# EAGLE design LyteLab_16x16_Base_Rev1 (EAGLE 6.4)
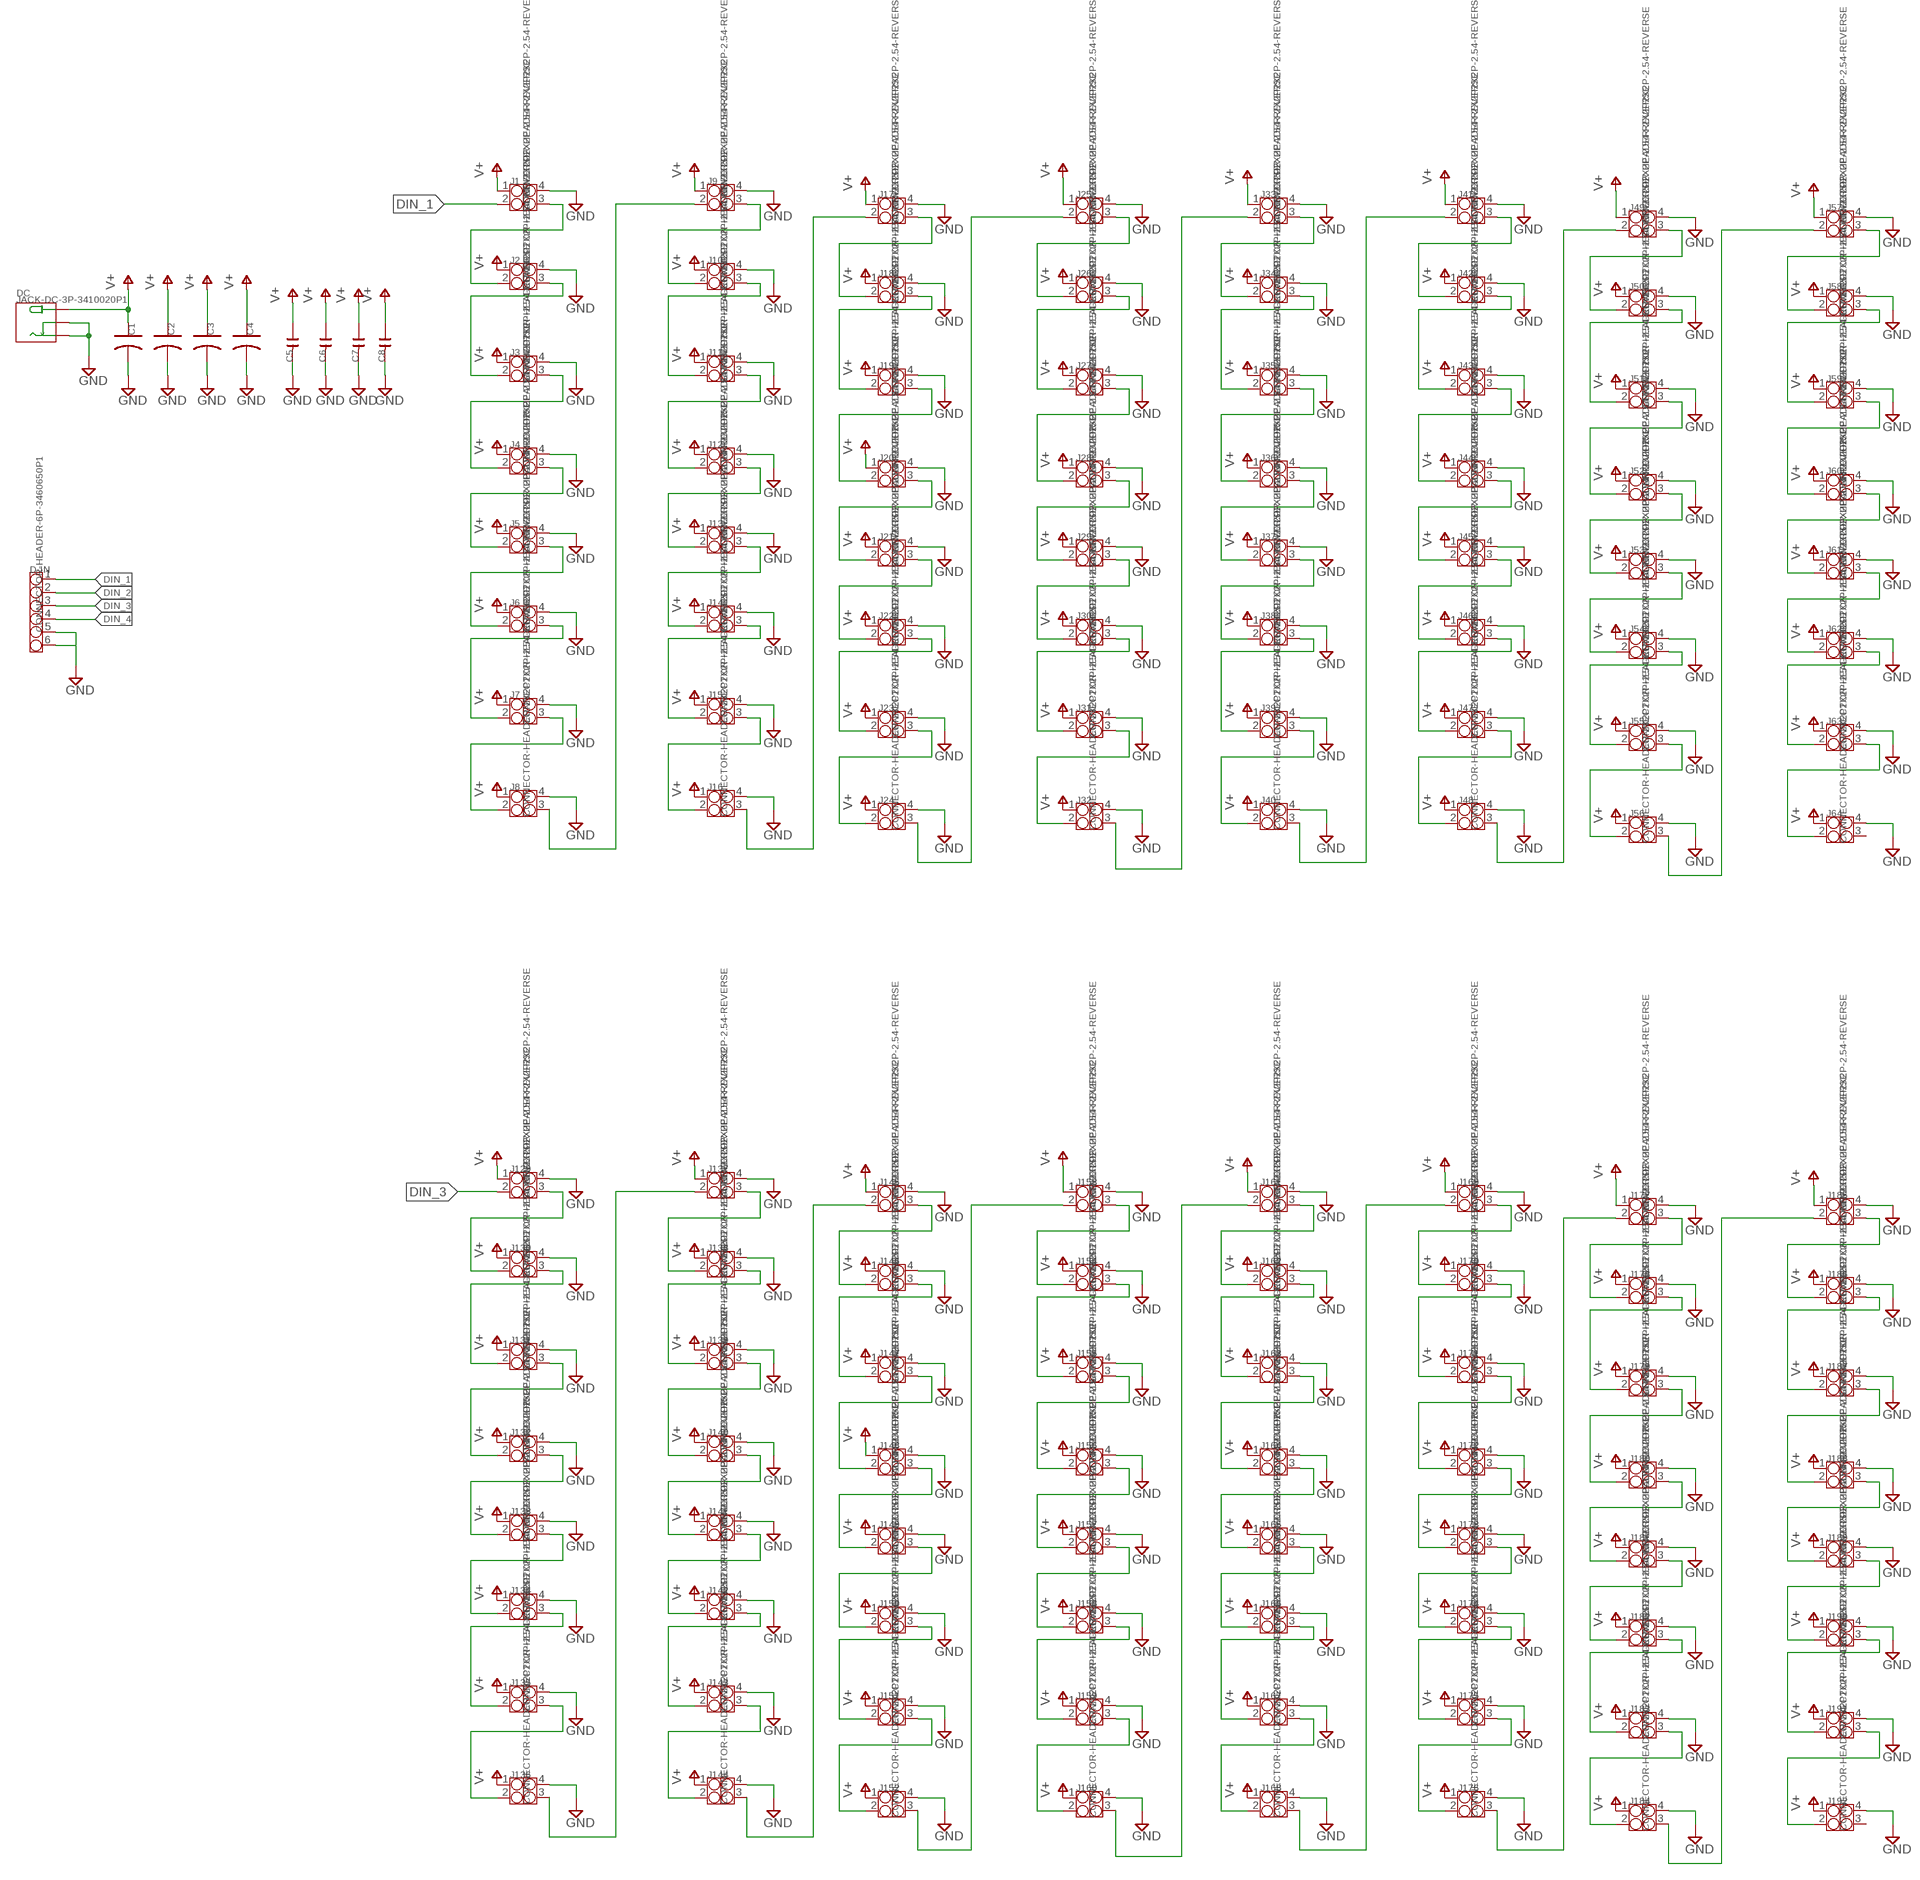
[diagram p0: schematic, sheet 1, part 1 of 2]
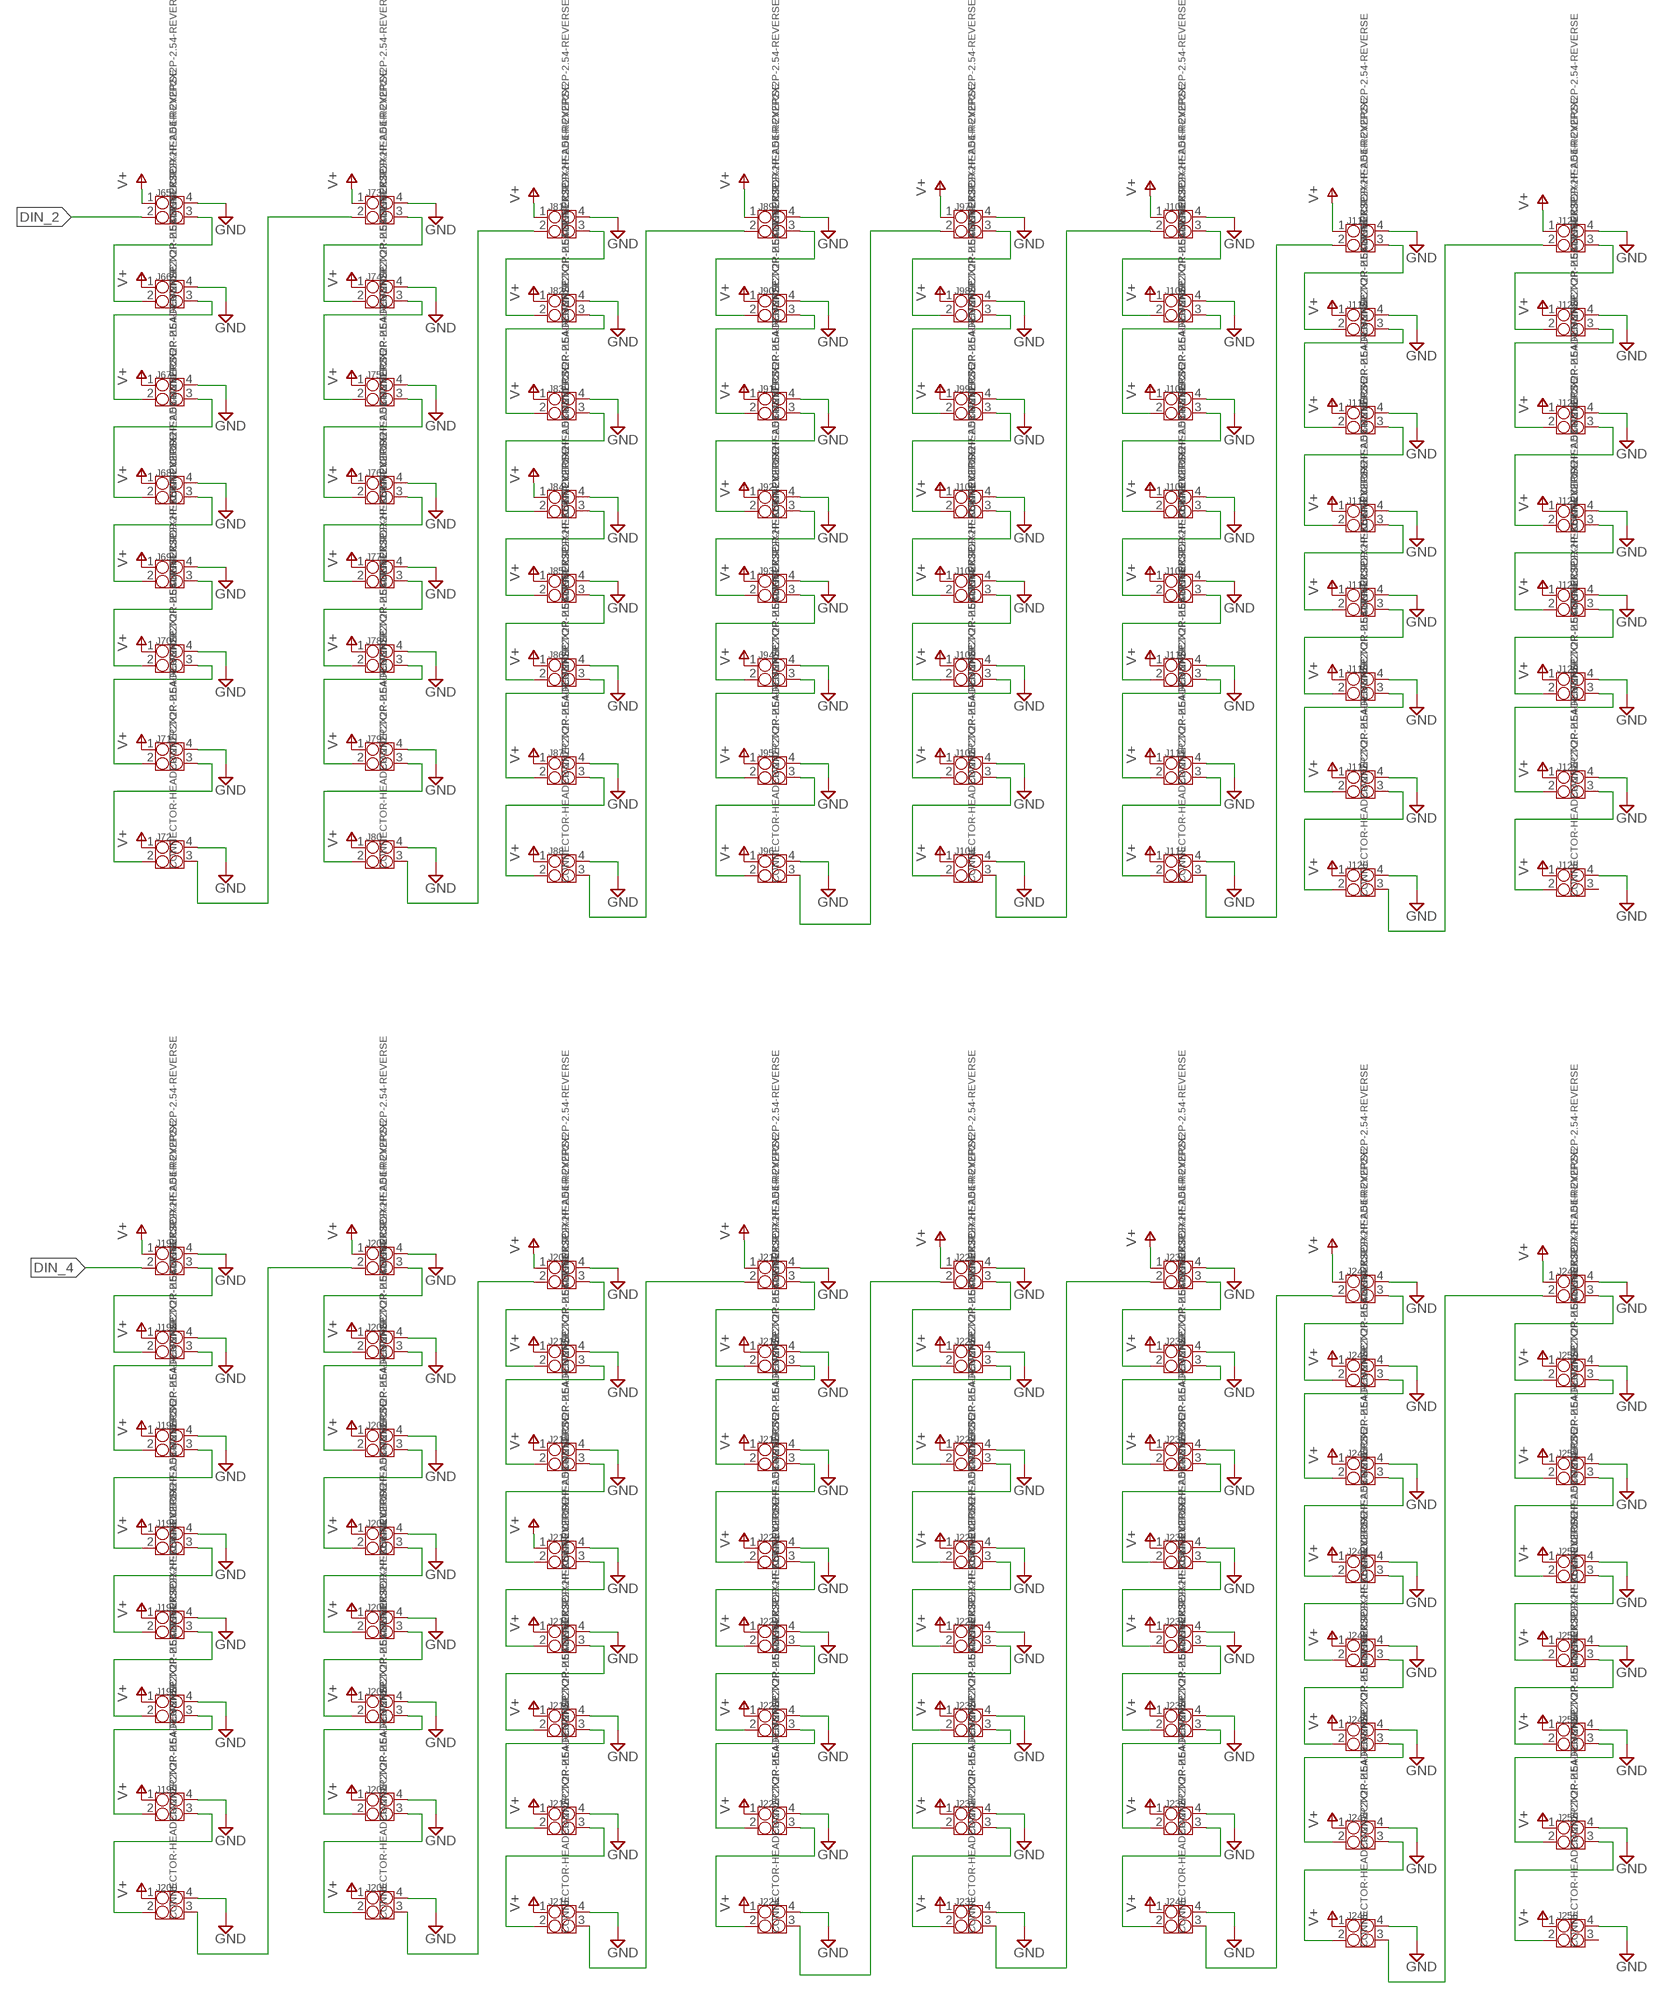
[diagram p1: schematic, sheet 1, part 2 of 2]

## Parts
C1  C-POLAR  [CAPACITOR-E3-8]
C2  C-POLAR  [CAPACITOR-E3-8]
C3  C-POLAR  [CAPACITOR-E3-8]
C4  C-POLAR  [CAPACITOR-E3-8]
C5  C-0603  [C0603]
C6  C-0603  [C0603]
C7  C-0603  [C0603]
C8  C-0603  [C0603]
D-IN  CONNECTOR-HEADER-6P-3460650P1  [1X6P-2.54-2.54-11.6-3.0-BLACK-MALE]
DC  JACK-DC-3P-3410020P1  [PW-3P-2.1]
J1  CONNECTOR-HEADER-2X2P2X2P-2.54-REVERSE  [2X2P-2.54-REVERSE]
J2  CONNECTOR-HEADER-2X2P2X2P-2.54-REVERSE  [2X2P-2.54-REVERSE]
J3  CONNECTOR-HEADER-2X2P2X2P-2.54-REVERSE  [2X2P-2.54-REVERSE]
J4  CONNECTOR-HEADER-2X2P2X2P-2.54-REVERSE  [2X2P-2.54-REVERSE]
J5  CONNECTOR-HEADER-2X2P2X2P-2.54-REVERSE  [2X2P-2.54-REVERSE]
J6  CONNECTOR-HEADER-2X2P2X2P-2.54-REVERSE  [2X2P-2.54-REVERSE]
J7  CONNECTOR-HEADER-2X2P2X2P-2.54-REVERSE  [2X2P-2.54-REVERSE]
J8  CONNECTOR-HEADER-2X2P2X2P-2.54-REVERSE  [2X2P-2.54-REVERSE]
J9  CONNECTOR-HEADER-2X2P2X2P-2.54-REVERSE  [2X2P-2.54-REVERSE]
J10  CONNECTOR-HEADER-2X2P2X2P-2.54-REVERSE  [2X2P-2.54-REVERSE]
J11  CONNECTOR-HEADER-2X2P2X2P-2.54-REVERSE  [2X2P-2.54-REVERSE]
J12  CONNECTOR-HEADER-2X2P2X2P-2.54-REVERSE  [2X2P-2.54-REVERSE]
J13  CONNECTOR-HEADER-2X2P2X2P-2.54-REVERSE  [2X2P-2.54-REVERSE]
J14  CONNECTOR-HEADER-2X2P2X2P-2.54-REVERSE  [2X2P-2.54-REVERSE]
J15  CONNECTOR-HEADER-2X2P2X2P-2.54-REVERSE  [2X2P-2.54-REVERSE]
J16  CONNECTOR-HEADER-2X2P2X2P-2.54-REVERSE  [2X2P-2.54-REVERSE]
J17  CONNECTOR-HEADER-2X2P2X2P-2.54-REVERSE  [2X2P-2.54-REVERSE]
J18  CONNECTOR-HEADER-2X2P2X2P-2.54-REVERSE  [2X2P-2.54-REVERSE]
J19  CONNECTOR-HEADER-2X2P2X2P-2.54-REVERSE  [2X2P-2.54-REVERSE]
J20  CONNECTOR-HEADER-2X2P2X2P-2.54-REVERSE  [2X2P-2.54-REVERSE]
J21  CONNECTOR-HEADER-2X2P2X2P-2.54-REVERSE  [2X2P-2.54-REVERSE]
J22  CONNECTOR-HEADER-2X2P2X2P-2.54-REVERSE  [2X2P-2.54-REVERSE]
J23  CONNECTOR-HEADER-2X2P2X2P-2.54-REVERSE  [2X2P-2.54-REVERSE]
J24  CONNECTOR-HEADER-2X2P2X2P-2.54-REVERSE  [2X2P-2.54-REVERSE]
J25  CONNECTOR-HEADER-2X2P2X2P-2.54-REVERSE  [2X2P-2.54-REVERSE]
J26  CONNECTOR-HEADER-2X2P2X2P-2.54-REVERSE  [2X2P-2.54-REVERSE]
J27  CONNECTOR-HEADER-2X2P2X2P-2.54-REVERSE  [2X2P-2.54-REVERSE]
J28  CONNECTOR-HEADER-2X2P2X2P-2.54-REVERSE  [2X2P-2.54-REVERSE]
J29  CONNECTOR-HEADER-2X2P2X2P-2.54-REVERSE  [2X2P-2.54-REVERSE]
J30  CONNECTOR-HEADER-2X2P2X2P-2.54-REVERSE  [2X2P-2.54-REVERSE]
J31  CONNECTOR-HEADER-2X2P2X2P-2.54-REVERSE  [2X2P-2.54-REVERSE]
J32  CONNECTOR-HEADER-2X2P2X2P-2.54-REVERSE  [2X2P-2.54-REVERSE]
J33  CONNECTOR-HEADER-2X2P2X2P-2.54-REVERSE  [2X2P-2.54-REVERSE]
J34  CONNECTOR-HEADER-2X2P2X2P-2.54-REVERSE  [2X2P-2.54-REVERSE]
J35  CONNECTOR-HEADER-2X2P2X2P-2.54-REVERSE  [2X2P-2.54-REVERSE]
J36  CONNECTOR-HEADER-2X2P2X2P-2.54-REVERSE  [2X2P-2.54-REVERSE]
J37  CONNECTOR-HEADER-2X2P2X2P-2.54-REVERSE  [2X2P-2.54-REVERSE]
J38  CONNECTOR-HEADER-2X2P2X2P-2.54-REVERSE  [2X2P-2.54-REVERSE]
J39  CONNECTOR-HEADER-2X2P2X2P-2.54-REVERSE  [2X2P-2.54-REVERSE]
J40  CONNECTOR-HEADER-2X2P2X2P-2.54-REVERSE  [2X2P-2.54-REVERSE]
J41  CONNECTOR-HEADER-2X2P2X2P-2.54-REVERSE  [2X2P-2.54-REVERSE]
J42  CONNECTOR-HEADER-2X2P2X2P-2.54-REVERSE  [2X2P-2.54-REVERSE]
J43  CONNECTOR-HEADER-2X2P2X2P-2.54-REVERSE  [2X2P-2.54-REVERSE]
J44  CONNECTOR-HEADER-2X2P2X2P-2.54-REVERSE  [2X2P-2.54-REVERSE]
J45  CONNECTOR-HEADER-2X2P2X2P-2.54-REVERSE  [2X2P-2.54-REVERSE]
J46  CONNECTOR-HEADER-2X2P2X2P-2.54-REVERSE  [2X2P-2.54-REVERSE]
J47  CONNECTOR-HEADER-2X2P2X2P-2.54-REVERSE  [2X2P-2.54-REVERSE]
J48  CONNECTOR-HEADER-2X2P2X2P-2.54-REVERSE  [2X2P-2.54-REVERSE]
J49  CONNECTOR-HEADER-2X2P2X2P-2.54-REVERSE  [2X2P-2.54-REVERSE]
J50  CONNECTOR-HEADER-2X2P2X2P-2.54-REVERSE  [2X2P-2.54-REVERSE]
J51  CONNECTOR-HEADER-2X2P2X2P-2.54-REVERSE  [2X2P-2.54-REVERSE]
J52  CONNECTOR-HEADER-2X2P2X2P-2.54-REVERSE  [2X2P-2.54-REVERSE]
J53  CONNECTOR-HEADER-2X2P2X2P-2.54-REVERSE  [2X2P-2.54-REVERSE]
J54  CONNECTOR-HEADER-2X2P2X2P-2.54-REVERSE  [2X2P-2.54-REVERSE]
J55  CONNECTOR-HEADER-2X2P2X2P-2.54-REVERSE  [2X2P-2.54-REVERSE]
J56  CONNECTOR-HEADER-2X2P2X2P-2.54-REVERSE  [2X2P-2.54-REVERSE]
J57  CONNECTOR-HEADER-2X2P2X2P-2.54-REVERSE  [2X2P-2.54-REVERSE]
J58  CONNECTOR-HEADER-2X2P2X2P-2.54-REVERSE  [2X2P-2.54-REVERSE]
J59  CONNECTOR-HEADER-2X2P2X2P-2.54-REVERSE  [2X2P-2.54-REVERSE]
J60  CONNECTOR-HEADER-2X2P2X2P-2.54-REVERSE  [2X2P-2.54-REVERSE]
J61  CONNECTOR-HEADER-2X2P2X2P-2.54-REVERSE  [2X2P-2.54-REVERSE]
J62  CONNECTOR-HEADER-2X2P2X2P-2.54-REVERSE  [2X2P-2.54-REVERSE]
J63  CONNECTOR-HEADER-2X2P2X2P-2.54-REVERSE  [2X2P-2.54-REVERSE]
J64  CONNECTOR-HEADER-2X2P2X2P-2.54-REVERSE  [2X2P-2.54-REVERSE]
J65  CONNECTOR-HEADER-2X2P2X2P-2.54-REVERSE  [2X2P-2.54-REVERSE]
J66  CONNECTOR-HEADER-2X2P2X2P-2.54-REVERSE  [2X2P-2.54-REVERSE]
J67  CONNECTOR-HEADER-2X2P2X2P-2.54-REVERSE  [2X2P-2.54-REVERSE]
J68  CONNECTOR-HEADER-2X2P2X2P-2.54-REVERSE  [2X2P-2.54-REVERSE]
J69  CONNECTOR-HEADER-2X2P2X2P-2.54-REVERSE  [2X2P-2.54-REVERSE]
J70  CONNECTOR-HEADER-2X2P2X2P-2.54-REVERSE  [2X2P-2.54-REVERSE]
J71  CONNECTOR-HEADER-2X2P2X2P-2.54-REVERSE  [2X2P-2.54-REVERSE]
J72  CONNECTOR-HEADER-2X2P2X2P-2.54-REVERSE  [2X2P-2.54-REVERSE]
J73  CONNECTOR-HEADER-2X2P2X2P-2.54-REVERSE  [2X2P-2.54-REVERSE]
J74  CONNECTOR-HEADER-2X2P2X2P-2.54-REVERSE  [2X2P-2.54-REVERSE]
J75  CONNECTOR-HEADER-2X2P2X2P-2.54-REVERSE  [2X2P-2.54-REVERSE]
J76  CONNECTOR-HEADER-2X2P2X2P-2.54-REVERSE  [2X2P-2.54-REVERSE]
J77  CONNECTOR-HEADER-2X2P2X2P-2.54-REVERSE  [2X2P-2.54-REVERSE]
J78  CONNECTOR-HEADER-2X2P2X2P-2.54-REVERSE  [2X2P-2.54-REVERSE]
J79  CONNECTOR-HEADER-2X2P2X2P-2.54-REVERSE  [2X2P-2.54-REVERSE]
J80  CONNECTOR-HEADER-2X2P2X2P-2.54-REVERSE  [2X2P-2.54-REVERSE]
J81  CONNECTOR-HEADER-2X2P2X2P-2.54-REVERSE  [2X2P-2.54-REVERSE]
J82  CONNECTOR-HEADER-2X2P2X2P-2.54-REVERSE  [2X2P-2.54-REVERSE]
J83  CONNECTOR-HEADER-2X2P2X2P-2.54-REVERSE  [2X2P-2.54-REVERSE]
J84  CONNECTOR-HEADER-2X2P2X2P-2.54-REVERSE  [2X2P-2.54-REVERSE]
J85  CONNECTOR-HEADER-2X2P2X2P-2.54-REVERSE  [2X2P-2.54-REVERSE]
J86  CONNECTOR-HEADER-2X2P2X2P-2.54-REVERSE  [2X2P-2.54-REVERSE]
J87  CONNECTOR-HEADER-2X2P2X2P-2.54-REVERSE  [2X2P-2.54-REVERSE]
J88  CONNECTOR-HEADER-2X2P2X2P-2.54-REVERSE  [2X2P-2.54-REVERSE]
J89  CONNECTOR-HEADER-2X2P2X2P-2.54-REVERSE  [2X2P-2.54-REVERSE]
J90  CONNECTOR-HEADER-2X2P2X2P-2.54-REVERSE  [2X2P-2.54-REVERSE]
J91  CONNECTOR-HEADER-2X2P2X2P-2.54-REVERSE  [2X2P-2.54-REVERSE]
J92  CONNECTOR-HEADER-2X2P2X2P-2.54-REVERSE  [2X2P-2.54-REVERSE]
J93  CONNECTOR-HEADER-2X2P2X2P-2.54-REVERSE  [2X2P-2.54-REVERSE]
J94  CONNECTOR-HEADER-2X2P2X2P-2.54-REVERSE  [2X2P-2.54-REVERSE]
J95  CONNECTOR-HEADER-2X2P2X2P-2.54-REVERSE  [2X2P-2.54-REVERSE]
J96  CONNECTOR-HEADER-2X2P2X2P-2.54-REVERSE  [2X2P-2.54-REVERSE]
J97  CONNECTOR-HEADER-2X2P2X2P-2.54-REVERSE  [2X2P-2.54-REVERSE]
J98  CONNECTOR-HEADER-2X2P2X2P-2.54-REVERSE  [2X2P-2.54-REVERSE]
J99  CONNECTOR-HEADER-2X2P2X2P-2.54-REVERSE  [2X2P-2.54-REVERSE]
J100  CONNECTOR-HEADER-2X2P2X2P-2.54-REVERSE  [2X2P-2.54-REVERSE]
J101  CONNECTOR-HEADER-2X2P2X2P-2.54-REVERSE  [2X2P-2.54-REVERSE]
J102  CONNECTOR-HEADER-2X2P2X2P-2.54-REVERSE  [2X2P-2.54-REVERSE]
J103  CONNECTOR-HEADER-2X2P2X2P-2.54-REVERSE  [2X2P-2.54-REVERSE]
J104  CONNECTOR-HEADER-2X2P2X2P-2.54-REVERSE  [2X2P-2.54-REVERSE]
J105  CONNECTOR-HEADER-2X2P2X2P-2.54-REVERSE  [2X2P-2.54-REVERSE]
J106  CONNECTOR-HEADER-2X2P2X2P-2.54-REVERSE  [2X2P-2.54-REVERSE]
J107  CONNECTOR-HEADER-2X2P2X2P-2.54-REVERSE  [2X2P-2.54-REVERSE]
J108  CONNECTOR-HEADER-2X2P2X2P-2.54-REVERSE  [2X2P-2.54-REVERSE]
J109  CONNECTOR-HEADER-2X2P2X2P-2.54-REVERSE  [2X2P-2.54-REVERSE]
J110  CONNECTOR-HEADER-2X2P2X2P-2.54-REVERSE  [2X2P-2.54-REVERSE]
J111  CONNECTOR-HEADER-2X2P2X2P-2.54-REVERSE  [2X2P-2.54-REVERSE]
J112  CONNECTOR-HEADER-2X2P2X2P-2.54-REVERSE  [2X2P-2.54-REVERSE]
J113  CONNECTOR-HEADER-2X2P2X2P-2.54-REVERSE  [2X2P-2.54-REVERSE]
J114  CONNECTOR-HEADER-2X2P2X2P-2.54-REVERSE  [2X2P-2.54-REVERSE]
J115  CONNECTOR-HEADER-2X2P2X2P-2.54-REVERSE  [2X2P-2.54-REVERSE]
J116  CONNECTOR-HEADER-2X2P2X2P-2.54-REVERSE  [2X2P-2.54-REVERSE]
J117  CONNECTOR-HEADER-2X2P2X2P-2.54-REVERSE  [2X2P-2.54-REVERSE]
J118  CONNECTOR-HEADER-2X2P2X2P-2.54-REVERSE  [2X2P-2.54-REVERSE]
J119  CONNECTOR-HEADER-2X2P2X2P-2.54-REVERSE  [2X2P-2.54-REVERSE]
J120  CONNECTOR-HEADER-2X2P2X2P-2.54-REVERSE  [2X2P-2.54-REVERSE]
J121  CONNECTOR-HEADER-2X2P2X2P-2.54-REVERSE  [2X2P-2.54-REVERSE]
J122  CONNECTOR-HEADER-2X2P2X2P-2.54-REVERSE  [2X2P-2.54-REVERSE]
J123  CONNECTOR-HEADER-2X2P2X2P-2.54-REVERSE  [2X2P-2.54-REVERSE]
J124  CONNECTOR-HEADER-2X2P2X2P-2.54-REVERSE  [2X2P-2.54-REVERSE]
J125  CONNECTOR-HEADER-2X2P2X2P-2.54-REVERSE  [2X2P-2.54-REVERSE]
J126  CONNECTOR-HEADER-2X2P2X2P-2.54-REVERSE  [2X2P-2.54-REVERSE]
J127  CONNECTOR-HEADER-2X2P2X2P-2.54-REVERSE  [2X2P-2.54-REVERSE]
J128  CONNECTOR-HEADER-2X2P2X2P-2.54-REVERSE  [2X2P-2.54-REVERSE]
J129  CONNECTOR-HEADER-2X2P2X2P-2.54-REVERSE  [2X2P-2.54-REVERSE]
J130  CONNECTOR-HEADER-2X2P2X2P-2.54-REVERSE  [2X2P-2.54-REVERSE]
J131  CONNECTOR-HEADER-2X2P2X2P-2.54-REVERSE  [2X2P-2.54-REVERSE]
J132  CONNECTOR-HEADER-2X2P2X2P-2.54-REVERSE  [2X2P-2.54-REVERSE]
J133  CONNECTOR-HEADER-2X2P2X2P-2.54-REVERSE  [2X2P-2.54-REVERSE]
J134  CONNECTOR-HEADER-2X2P2X2P-2.54-REVERSE  [2X2P-2.54-REVERSE]
J135  CONNECTOR-HEADER-2X2P2X2P-2.54-REVERSE  [2X2P-2.54-REVERSE]
J136  CONNECTOR-HEADER-2X2P2X2P-2.54-REVERSE  [2X2P-2.54-REVERSE]
J137  CONNECTOR-HEADER-2X2P2X2P-2.54-REVERSE  [2X2P-2.54-REVERSE]
J138  CONNECTOR-HEADER-2X2P2X2P-2.54-REVERSE  [2X2P-2.54-REVERSE]
J139  CONNECTOR-HEADER-2X2P2X2P-2.54-REVERSE  [2X2P-2.54-REVERSE]
J140  CONNECTOR-HEADER-2X2P2X2P-2.54-REVERSE  [2X2P-2.54-REVERSE]
J141  CONNECTOR-HEADER-2X2P2X2P-2.54-REVERSE  [2X2P-2.54-REVERSE]
J142  CONNECTOR-HEADER-2X2P2X2P-2.54-REVERSE  [2X2P-2.54-REVERSE]
J143  CONNECTOR-HEADER-2X2P2X2P-2.54-REVERSE  [2X2P-2.54-REVERSE]
J144  CONNECTOR-HEADER-2X2P2X2P-2.54-REVERSE  [2X2P-2.54-REVERSE]
J145  CONNECTOR-HEADER-2X2P2X2P-2.54-REVERSE  [2X2P-2.54-REVERSE]
J146  CONNECTOR-HEADER-2X2P2X2P-2.54-REVERSE  [2X2P-2.54-REVERSE]
J147  CONNECTOR-HEADER-2X2P2X2P-2.54-REVERSE  [2X2P-2.54-REVERSE]
J148  CONNECTOR-HEADER-2X2P2X2P-2.54-REVERSE  [2X2P-2.54-REVERSE]
J149  CONNECTOR-HEADER-2X2P2X2P-2.54-REVERSE  [2X2P-2.54-REVERSE]
J150  CONNECTOR-HEADER-2X2P2X2P-2.54-REVERSE  [2X2P-2.54-REVERSE]
J151  CONNECTOR-HEADER-2X2P2X2P-2.54-REVERSE  [2X2P-2.54-REVERSE]
J152  CONNECTOR-HEADER-2X2P2X2P-2.54-REVERSE  [2X2P-2.54-REVERSE]
J153  CONNECTOR-HEADER-2X2P2X2P-2.54-REVERSE  [2X2P-2.54-REVERSE]
J154  CONNECTOR-HEADER-2X2P2X2P-2.54-REVERSE  [2X2P-2.54-REVERSE]
J155  CONNECTOR-HEADER-2X2P2X2P-2.54-REVERSE  [2X2P-2.54-REVERSE]
J156  CONNECTOR-HEADER-2X2P2X2P-2.54-REVERSE  [2X2P-2.54-REVERSE]
J157  CONNECTOR-HEADER-2X2P2X2P-2.54-REVERSE  [2X2P-2.54-REVERSE]
J158  CONNECTOR-HEADER-2X2P2X2P-2.54-REVERSE  [2X2P-2.54-REVERSE]
J159  CONNECTOR-HEADER-2X2P2X2P-2.54-REVERSE  [2X2P-2.54-REVERSE]
J160  CONNECTOR-HEADER-2X2P2X2P-2.54-REVERSE  [2X2P-2.54-REVERSE]
J161  CONNECTOR-HEADER-2X2P2X2P-2.54-REVERSE  [2X2P-2.54-REVERSE]
J162  CONNECTOR-HEADER-2X2P2X2P-2.54-REVERSE  [2X2P-2.54-REVERSE]
J163  CONNECTOR-HEADER-2X2P2X2P-2.54-REVERSE  [2X2P-2.54-REVERSE]
J164  CONNECTOR-HEADER-2X2P2X2P-2.54-REVERSE  [2X2P-2.54-REVERSE]
J165  CONNECTOR-HEADER-2X2P2X2P-2.54-REVERSE  [2X2P-2.54-REVERSE]
J166  CONNECTOR-HEADER-2X2P2X2P-2.54-REVERSE  [2X2P-2.54-REVERSE]
J167  CONNECTOR-HEADER-2X2P2X2P-2.54-REVERSE  [2X2P-2.54-REVERSE]
J168  CONNECTOR-HEADER-2X2P2X2P-2.54-REVERSE  [2X2P-2.54-REVERSE]
J169  CONNECTOR-HEADER-2X2P2X2P-2.54-REVERSE  [2X2P-2.54-REVERSE]
J170  CONNECTOR-HEADER-2X2P2X2P-2.54-REVERSE  [2X2P-2.54-REVERSE]
J171  CONNECTOR-HEADER-2X2P2X2P-2.54-REVERSE  [2X2P-2.54-REVERSE]
J172  CONNECTOR-HEADER-2X2P2X2P-2.54-REVERSE  [2X2P-2.54-REVERSE]
J173  CONNECTOR-HEADER-2X2P2X2P-2.54-REVERSE  [2X2P-2.54-REVERSE]
J174  CONNECTOR-HEADER-2X2P2X2P-2.54-REVERSE  [2X2P-2.54-REVERSE]
J175  CONNECTOR-HEADER-2X2P2X2P-2.54-REVERSE  [2X2P-2.54-REVERSE]
J176  CONNECTOR-HEADER-2X2P2X2P-2.54-REVERSE  [2X2P-2.54-REVERSE]
J177  CONNECTOR-HEADER-2X2P2X2P-2.54-REVERSE  [2X2P-2.54-REVERSE]
J178  CONNECTOR-HEADER-2X2P2X2P-2.54-REVERSE  [2X2P-2.54-REVERSE]
J179  CONNECTOR-HEADER-2X2P2X2P-2.54-REVERSE  [2X2P-2.54-REVERSE]
J180  CONNECTOR-HEADER-2X2P2X2P-2.54-REVERSE  [2X2P-2.54-REVERSE]
J181  CONNECTOR-HEADER-2X2P2X2P-2.54-REVERSE  [2X2P-2.54-REVERSE]
J182  CONNECTOR-HEADER-2X2P2X2P-2.54-REVERSE  [2X2P-2.54-REVERSE]
J183  CONNECTOR-HEADER-2X2P2X2P-2.54-REVERSE  [2X2P-2.54-REVERSE]
J184  CONNECTOR-HEADER-2X2P2X2P-2.54-REVERSE  [2X2P-2.54-REVERSE]
J185  CONNECTOR-HEADER-2X2P2X2P-2.54-REVERSE  [2X2P-2.54-REVERSE]
J186  CONNECTOR-HEADER-2X2P2X2P-2.54-REVERSE  [2X2P-2.54-REVERSE]
J187  CONNECTOR-HEADER-2X2P2X2P-2.54-REVERSE  [2X2P-2.54-REVERSE]
J188  CONNECTOR-HEADER-2X2P2X2P-2.54-REVERSE  [2X2P-2.54-REVERSE]
J189  CONNECTOR-HEADER-2X2P2X2P-2.54-REVERSE  [2X2P-2.54-REVERSE]
J190  CONNECTOR-HEADER-2X2P2X2P-2.54-REVERSE  [2X2P-2.54-REVERSE]
J191  CONNECTOR-HEADER-2X2P2X2P-2.54-REVERSE  [2X2P-2.54-REVERSE]
J192  CONNECTOR-HEADER-2X2P2X2P-2.54-REVERSE  [2X2P-2.54-REVERSE]
J193  CONNECTOR-HEADER-2X2P2X2P-2.54-REVERSE  [2X2P-2.54-REVERSE]
J194  CONNECTOR-HEADER-2X2P2X2P-2.54-REVERSE  [2X2P-2.54-REVERSE]
J195  CONNECTOR-HEADER-2X2P2X2P-2.54-REVERSE  [2X2P-2.54-REVERSE]
J196  CONNECTOR-HEADER-2X2P2X2P-2.54-REVERSE  [2X2P-2.54-REVERSE]
J197  CONNECTOR-HEADER-2X2P2X2P-2.54-REVERSE  [2X2P-2.54-REVERSE]
J198  CONNECTOR-HEADER-2X2P2X2P-2.54-REVERSE  [2X2P-2.54-REVERSE]
J199  CONNECTOR-HEADER-2X2P2X2P-2.54-REVERSE  [2X2P-2.54-REVERSE]
J200  CONNECTOR-HEADER-2X2P2X2P-2.54-REVERSE  [2X2P-2.54-REVERSE]
J201  CONNECTOR-HEADER-2X2P2X2P-2.54-REVERSE  [2X2P-2.54-REVERSE]
J202  CONNECTOR-HEADER-2X2P2X2P-2.54-REVERSE  [2X2P-2.54-REVERSE]
J203  CONNECTOR-HEADER-2X2P2X2P-2.54-REVERSE  [2X2P-2.54-REVERSE]
J204  CONNECTOR-HEADER-2X2P2X2P-2.54-REVERSE  [2X2P-2.54-REVERSE]
J205  CONNECTOR-HEADER-2X2P2X2P-2.54-REVERSE  [2X2P-2.54-REVERSE]
J206  CONNECTOR-HEADER-2X2P2X2P-2.54-REVERSE  [2X2P-2.54-REVERSE]
J207  CONNECTOR-HEADER-2X2P2X2P-2.54-REVERSE  [2X2P-2.54-REVERSE]
J208  CONNECTOR-HEADER-2X2P2X2P-2.54-REVERSE  [2X2P-2.54-REVERSE]
J209  CONNECTOR-HEADER-2X2P2X2P-2.54-REVERSE  [2X2P-2.54-REVERSE]
J210  CONNECTOR-HEADER-2X2P2X2P-2.54-REVERSE  [2X2P-2.54-REVERSE]
J211  CONNECTOR-HEADER-2X2P2X2P-2.54-REVERSE  [2X2P-2.54-REVERSE]
J212  CONNECTOR-HEADER-2X2P2X2P-2.54-REVERSE  [2X2P-2.54-REVERSE]
J213  CONNECTOR-HEADER-2X2P2X2P-2.54-REVERSE  [2X2P-2.54-REVERSE]
J214  CONNECTOR-HEADER-2X2P2X2P-2.54-REVERSE  [2X2P-2.54-REVERSE]
J215  CONNECTOR-HEADER-2X2P2X2P-2.54-REVERSE  [2X2P-2.54-REVERSE]
J216  CONNECTOR-HEADER-2X2P2X2P-2.54-REVERSE  [2X2P-2.54-REVERSE]
J217  CONNECTOR-HEADER-2X2P2X2P-2.54-REVERSE  [2X2P-2.54-REVERSE]
J218  CONNECTOR-HEADER-2X2P2X2P-2.54-REVERSE  [2X2P-2.54-REVERSE]
J219  CONNECTOR-HEADER-2X2P2X2P-2.54-REVERSE  [2X2P-2.54-REVERSE]
J220  CONNECTOR-HEADER-2X2P2X2P-2.54-REVERSE  [2X2P-2.54-REVERSE]
J221  CONNECTOR-HEADER-2X2P2X2P-2.54-REVERSE  [2X2P-2.54-REVERSE]
J222  CONNECTOR-HEADER-2X2P2X2P-2.54-REVERSE  [2X2P-2.54-REVERSE]
J223  CONNECTOR-HEADER-2X2P2X2P-2.54-REVERSE  [2X2P-2.54-REVERSE]
J224  CONNECTOR-HEADER-2X2P2X2P-2.54-REVERSE  [2X2P-2.54-REVERSE]
J225  CONNECTOR-HEADER-2X2P2X2P-2.54-REVERSE  [2X2P-2.54-REVERSE]
J226  CONNECTOR-HEADER-2X2P2X2P-2.54-REVERSE  [2X2P-2.54-REVERSE]
J227  CONNECTOR-HEADER-2X2P2X2P-2.54-REVERSE  [2X2P-2.54-REVERSE]
J228  CONNECTOR-HEADER-2X2P2X2P-2.54-REVERSE  [2X2P-2.54-REVERSE]
J229  CONNECTOR-HEADER-2X2P2X2P-2.54-REVERSE  [2X2P-2.54-REVERSE]
J230  CONNECTOR-HEADER-2X2P2X2P-2.54-REVERSE  [2X2P-2.54-REVERSE]
J231  CONNECTOR-HEADER-2X2P2X2P-2.54-REVERSE  [2X2P-2.54-REVERSE]
J232  CONNECTOR-HEADER-2X2P2X2P-2.54-REVERSE  [2X2P-2.54-REVERSE]
J233  CONNECTOR-HEADER-2X2P2X2P-2.54-REVERSE  [2X2P-2.54-REVERSE]
J234  CONNECTOR-HEADER-2X2P2X2P-2.54-REVERSE  [2X2P-2.54-REVERSE]
J235  CONNECTOR-HEADER-2X2P2X2P-2.54-REVERSE  [2X2P-2.54-REVERSE]
J236  CONNECTOR-HEADER-2X2P2X2P-2.54-REVERSE  [2X2P-2.54-REVERSE]
J237  CONNECTOR-HEADER-2X2P2X2P-2.54-REVERSE  [2X2P-2.54-REVERSE]
J238  CONNECTOR-HEADER-2X2P2X2P-2.54-REVERSE  [2X2P-2.54-REVERSE]
J239  CONNECTOR-HEADER-2X2P2X2P-2.54-REVERSE  [2X2P-2.54-REVERSE]
J240  CONNECTOR-HEADER-2X2P2X2P-2.54-REVERSE  [2X2P-2.54-REVERSE]
J241  CONNECTOR-HEADER-2X2P2X2P-2.54-REVERSE  [2X2P-2.54-REVERSE]
J242  CONNECTOR-HEADER-2X2P2X2P-2.54-REVERSE  [2X2P-2.54-REVERSE]
J243  CONNECTOR-HEADER-2X2P2X2P-2.54-REVERSE  [2X2P-2.54-REVERSE]
J244  CONNECTOR-HEADER-2X2P2X2P-2.54-REVERSE  [2X2P-2.54-REVERSE]
J245  CONNECTOR-HEADER-2X2P2X2P-2.54-REVERSE  [2X2P-2.54-REVERSE]
J246  CONNECTOR-HEADER-2X2P2X2P-2.54-REVERSE  [2X2P-2.54-REVERSE]
J247  CONNECTOR-HEADER-2X2P2X2P-2.54-REVERSE  [2X2P-2.54-REVERSE]
J248  CONNECTOR-HEADER-2X2P2X2P-2.54-REVERSE  [2X2P-2.54-REVERSE]
J249  CONNECTOR-HEADER-2X2P2X2P-2.54-REVERSE  [2X2P-2.54-REVERSE]
J250  CONNECTOR-HEADER-2X2P2X2P-2.54-REVERSE  [2X2P-2.54-REVERSE]
J251  CONNECTOR-HEADER-2X2P2X2P-2.54-REVERSE  [2X2P-2.54-REVERSE]
J252  CONNECTOR-HEADER-2X2P2X2P-2.54-REVERSE  [2X2P-2.54-REVERSE]
J253  CONNECTOR-HEADER-2X2P2X2P-2.54-REVERSE  [2X2P-2.54-REVERSE]
J254  CONNECTOR-HEADER-2X2P2X2P-2.54-REVERSE  [2X2P-2.54-REVERSE]
J255  CONNECTOR-HEADER-2X2P2X2P-2.54-REVERSE  [2X2P-2.54-REVERSE]
J256  CONNECTOR-HEADER-2X2P2X2P-2.54-REVERSE  [2X2P-2.54-REVERSE]

## Nets
DIN_1: D-IN.1 J1.2
DIN_2: D-IN.2 J65.2
DIN_3: D-IN.3 J129.2
DIN_4: D-IN.4 J193.2
GND: C1.- C2.- C3.- C4.- C5.1 C6.1 C7.1 C8.1 D-IN.5 D-IN.6 DC.-1(-) DC.-2(CDN) DC.P$1(-) DC.P$2(-) DC.P$3(-) DC.P$4(-) DC.P$5(-) DC.P$6(-) DC.P$7(-) DC.P$8(-) DC.P$9(-) DC.P$10(-) DC.P$11(-) DC.P$12(-) DC.P$13(-) DC.P$14(-) DC.P$15(-) DC.P$16(-) DC.P$17(-) DC.P$18(-) DC.P$40(CDN) DC.P$41(CDN) DC.P$42(CDN) DC.P$43(CDN) DC.P$44(CDN) DC.P$45(CDN) DC.P$46(CDN) DC.P$47(CDN) DC.P$48(CDN) DC.P$49(CDN) DC.P$50(CDN) DC.P$51(CDN) DC.P$52(CDN) DC.P$53(CDN) DC.P$54(CDN) DC.P$55(CDN) DC.P$56(CDN) DC.P$57(CDN) DC.P$58(CDN) DC.P$59(CDN) DC.P$60(-) DC.P$61(-) J1.4 J2.4 J3.4 J4.4 J5.4 J6.4 J7.4 J8.4 J9.4 J10.4 J11.4 J12.4 J13.4 J14.4 J15.4 J16.4 J17.4 J18.4 J19.4 J20.4 J21.4 J22.4 J23.4 J24.4 J25.4 J26.4 J27.4 J28.4 J29.4 J30.4 J31.4 J32.4 J33.4 J34.4 J35.4 J36.4 J37.4 J38.4 J39.4 J40.4 J41.4 J42.4 J43.4 J44.4 J45.4 J46.4 J47.4 J48.4 J49.4 J50.4 J51.4 J52.4 J53.4 J54.4 J55.4 J56.4 J57.4 J58.4 J59.4 J60.4 J61.4 J62.4 J63.4 J64.4 J65.4 J66.4 J67.4 J68.4 J69.4 J70.4 J71.4 J72.4 J73.4 J74.4 J75.4 J76.4 J77.4 J78.4 J79.4 J80.4 J81.4 J82.4 J83.4 J84.4 J85.4 J86.4 J87.4 J88.4 J89.4 J90.4 J91.4 J92.4 J93.4 J94.4 J95.4 J96.4 J97.4 J98.4 J99.4 J100.4 J101.4 J102.4 J103.4 J104.4 J105.4 J106.4 J107.4 J108.4 J109.4 J110.4 J111.4 J112.4 J113.4 J114.4 J115.4 J116.4 J117.4 J118.4 J119.4 J120.4 J121.4 J122.4 J123.4 J124.4 J125.4 J126.4 J127.4 J128.4 J129.4 J130.4 J131.4 J132.4 J133.4 J134.4 J135.4 J136.4 J137.4 J138.4 J139.4 J140.4 J141.4 J142.4 J143.4 J144.4 J145.4 J146.4 J147.4 J148.4 J149.4 J150.4 J151.4 J152.4 J153.4 J154.4 J155.4 J156.4 J157.4 J158.4 J159.4 J160.4 J161.4 J162.4 J163.4 J164.4 J165.4 J166.4 J167.4 J168.4 J169.4 J170.4 J171.4 J172.4 J173.4 J174.4 J175.4 J176.4 J177.4 J178.4 J179.4 J180.4 J181.4 J182.4 J183.4 J184.4 J185.4 J186.4 J187.4 J188.4 J189.4 J190.4 J191.4 J192.4 J193.4 J194.4 J195.4 J196.4 J197.4 J198.4 J199.4 J200.4 J201.4 J202.4 J203.4 J204.4 J205.4 J206.4 J207.4 J208.4 J209.4 J210.4 J211.4 J212.4 J213.4 J214.4 J215.4 J216.4 J217.4 J218.4 J219.4 J220.4 J221.4 J222.4 J223.4 J224.4 J225.4 J226.4 J227.4 J228.4 J229.4 J230.4 J231.4 J232.4 J233.4 J234.4 J235.4 J236.4 J237.4 J238.4 J239.4 J240.4 J241.4 J242.4 J243.4 J244.4 J245.4 J246.4 J247.4 J248.4 J249.4 J250.4 J251.4 J252.4 J253.4 J254.4 J255.4 J256.4
N$1: J1.3 J2.2
N$2: J2.3 J3.2
N$3: J3.3 J4.2
N$4: J5.3 J6.2
N$5: J6.3 J7.2
N$6: J7.3 J8.2
N$7: J4.3 J5.2
N$8: J9.3 J10.2
N$9: J10.3 J11.2
N$10: J11.3 J12.2
N$11: J13.3 J14.2
N$12: J14.3 J15.2
N$13: J15.3 J16.2
N$14: J12.3 J13.2
N$15: J17.3 J18.2
N$16: J18.3 J19.2
N$17: J19.3 J20.2
N$18: J21.3 J22.2
N$19: J22.3 J23.2
N$20: J23.3 J24.2
N$21: J20.3 J21.2
N$22: J25.3 J26.2
N$23: J26.3 J27.2
N$24: J27.3 J28.2
N$25: J29.3 J30.2
N$26: J30.3 J31.2
N$27: J31.3 J32.2
N$28: J28.3 J29.2
N$29: J8.3 J9.2
N$30: J16.3 J17.2
N$31: J24.3 J25.2
N$32: J65.3 J66.2
N$33: J33.3 J34.2
N$34: J34.3 J35.2
N$35: J35.3 J36.2
N$36: J37.3 J38.2
N$37: J38.3 J39.2
N$38: J39.3 J40.2
N$39: J36.3 J37.2
N$40: J41.3 J42.2
N$41: J42.3 J43.2
N$42: J43.3 J44.2
N$43: J45.3 J46.2
N$44: J46.3 J47.2
N$45: J47.3 J48.2
N$46: J44.3 J45.2
N$47: J49.3 J50.2
N$48: J50.3 J51.2
N$49: J51.3 J52.2
N$50: J53.3 J54.2
N$51: J54.3 J55.2
N$52: J55.3 J56.2
N$53: J52.3 J53.2
N$54: J57.3 J58.2
N$55: J58.3 J59.2
N$56: J59.3 J60.2
N$57: J61.3 J62.2
N$58: J62.3 J63.2
N$59: J63.3 J64.2
N$60: J60.3 J61.2
N$61: J40.3 J41.2
N$62: J48.3 J49.2
N$63: J56.3 J57.2
N$64: J32.3 J33.2
N$65: J66.3 J67.2
N$66: J67.3 J68.2
N$67: J69.3 J70.2
N$68: J70.3 J71.2
N$69: J71.3 J72.2
N$70: J68.3 J69.2
N$71: J73.3 J74.2
N$72: J74.3 J75.2
N$73: J75.3 J76.2
N$74: J77.3 J78.2
N$75: J78.3 J79.2
N$76: J79.3 J80.2
N$77: J76.3 J77.2
N$78: J81.3 J82.2
N$79: J82.3 J83.2
N$80: J83.3 J84.2
N$81: J85.3 J86.2
N$82: J86.3 J87.2
N$83: J87.3 J88.2
N$84: J84.3 J85.2
N$85: J89.3 J90.2
N$86: J90.3 J91.2
N$87: J91.3 J92.2
N$88: J93.3 J94.2
N$89: J94.3 J95.2
N$90: J95.3 J96.2
N$91: J92.3 J93.2
N$92: J72.3 J73.2
N$93: J80.3 J81.2
N$94: J88.3 J89.2
N$95: J97.3 J98.2
N$96: J98.3 J99.2
N$97: J99.3 J100.2
N$98: J101.3 J102.2
N$99: J102.3 J103.2
N$100: J103.3 J104.2
N$101: J100.3 J101.2
N$102: J105.3 J106.2
N$103: J106.3 J107.2
N$104: J107.3 J108.2
N$105: J109.3 J110.2
N$106: J110.3 J111.2
N$107: J111.3 J112.2
N$108: J108.3 J109.2
N$109: J113.3 J114.2
N$110: J114.3 J115.2
N$111: J115.3 J116.2
N$112: J117.3 J118.2
N$113: J118.3 J119.2
N$114: J119.3 J120.2
N$115: J116.3 J117.2
N$116: J121.3 J122.2
N$117: J122.3 J123.2
N$118: J123.3 J124.2
N$119: J125.3 J126.2
N$120: J126.3 J127.2
N$121: J127.3 J128.2
N$122: J124.3 J125.2
N$123: J104.3 J105.2
N$124: J112.3 J113.2
N$125: J120.3 J121.2
N$126: J96.3 J97.2
N$127: J129.3 J130.2
N$128: J130.3 J131.2
N$129: J131.3 J132.2
N$130: J133.3 J134.2
N$131: J134.3 J135.2
N$132: J135.3 J136.2
N$133: J132.3 J133.2
N$134: J137.3 J138.2
N$135: J138.3 J139.2
N$136: J139.3 J140.2
N$137: J141.3 J142.2
N$138: J142.3 J143.2
N$139: J143.3 J144.2
N$140: J140.3 J141.2
N$141: J145.3 J146.2
N$142: J146.3 J147.2
N$143: J147.3 J148.2
N$144: J149.3 J150.2
N$145: J150.3 J151.2
N$146: J151.3 J152.2
N$147: J148.3 J149.2
N$148: J153.3 J154.2
N$149: J154.3 J155.2
N$150: J155.3 J156.2
N$151: J157.3 J158.2
N$152: J158.3 J159.2
N$153: J159.3 J160.2
N$154: J156.3 J157.2
N$155: J136.3 J137.2
N$156: J144.3 J145.2
N$157: J152.3 J153.2
N$158: J161.3 J162.2
N$159: J162.3 J163.2
N$160: J163.3 J164.2
N$161: J165.3 J166.2
N$162: J166.3 J167.2
N$163: J167.3 J168.2
N$164: J164.3 J165.2
N$165: J169.3 J170.2
N$166: J170.3 J171.2
N$167: J171.3 J172.2
N$168: J173.3 J174.2
N$169: J174.3 J175.2
N$170: J175.3 J176.2
N$171: J172.3 J173.2
N$172: J177.3 J178.2
N$173: J178.3 J179.2
N$174: J179.3 J180.2
N$175: J181.3 J182.2
N$176: J182.3 J183.2
N$177: J183.3 J184.2
N$178: J180.3 J181.2
N$179: J185.3 J186.2
N$180: J186.3 J187.2
N$181: J187.3 J188.2
N$182: J189.3 J190.2
N$183: J190.3 J191.2
N$184: J191.3 J192.2
N$185: J188.3 J189.2
N$186: J168.3 J169.2
N$187: J176.3 J177.2
N$188: J184.3 J185.2
N$189: J160.3 J161.2
N$190: J193.3 J194.2
N$191: J194.3 J195.2
N$192: J195.3 J196.2
N$193: J197.3 J198.2
N$194: J198.3 J199.2
N$195: J199.3 J200.2
N$196: J196.3 J197.2
N$197: J201.3 J202.2
N$198: J202.3 J203.2
N$199: J203.3 J204.2
N$200: J205.3 J206.2
N$201: J206.3 J207.2
N$202: J207.3 J208.2
N$203: J204.3 J205.2
N$204: J209.3 J210.2
N$205: J210.3 J211.2
N$206: J211.3 J212.2
N$207: J213.3 J214.2
N$208: J214.3 J215.2
N$209: J215.3 J216.2
N$210: J212.3 J213.2
N$211: J217.3 J218.2
N$212: J218.3 J219.2
N$213: J219.3 J220.2
N$214: J221.3 J222.2
N$215: J222.3 J223.2
N$216: J223.3 J224.2
N$217: J220.3 J221.2
N$218: J200.3 J201.2
N$219: J208.3 J209.2
N$220: J216.3 J217.2
N$221: J225.3 J226.2
N$222: J226.3 J227.2
N$223: J227.3 J228.2
N$224: J229.3 J230.2
N$225: J230.3 J231.2
N$226: J231.3 J232.2
N$227: J228.3 J229.2
N$228: J233.3 J234.2
N$229: J234.3 J235.2
N$230: J235.3 J236.2
N$231: J237.3 J238.2
N$232: J238.3 J239.2
N$233: J239.3 J240.2
N$234: J236.3 J237.2
N$235: J241.3 J242.2
N$236: J242.3 J243.2
N$237: J243.3 J244.2
N$238: J245.3 J246.2
N$239: J246.3 J247.2
N$240: J247.3 J248.2
N$241: J244.3 J245.2
N$242: J249.3 J250.2
N$243: J250.3 J251.2
N$244: J251.3 J252.2
N$245: J253.3 J254.2
N$246: J254.3 J255.2
N$247: J255.3 J256.2
N$248: J252.3 J253.2
N$249: J232.3 J233.2
N$250: J240.3 J241.2
N$251: J248.3 J249.2
N$252: J224.3 J225.2
V+: C1.+ C2.+ C3.+ C4.+ C5.2 C6.2 C7.2 C8.2 DC.+ DC.P$19(+) DC.P$20(+) DC.P$21(+) DC.P$22(+) DC.P$23(+) DC.P$24(+) DC.P$25(+) DC.P$26(+) DC.P$27(+) DC.P$28(+) DC.P$29(+) DC.P$30(+) DC.P$31(+) DC.P$32(+) DC.P$33(+) DC.P$34(+) DC.P$35(+) DC.P$36(+) DC.P$37(+) DC.P$38(+) DC.P$39(+) J1.1 J2.1 J3.1 J4.1 J5.1 J6.1 J7.1 J8.1 J9.1 J10.1 J11.1 J12.1 J13.1 J14.1 J15.1 J16.1 J17.1 J18.1 J19.1 J20.1 J21.1 J22.1 J23.1 J24.1 J25.1 J26.1 J27.1 J28.1 J29.1 J30.1 J31.1 J32.1 J33.1 J34.1 J35.1 J36.1 J37.1 J38.1 J39.1 J40.1 J41.1 J42.1 J43.1 J44.1 J45.1 J46.1 J47.1 J48.1 J49.1 J50.1 J51.1 J52.1 J53.1 J54.1 J55.1 J56.1 J57.1 J58.1 J59.1 J60.1 J61.1 J62.1 J63.1 J64.1 J65.1 J66.1 J67.1 J68.1 J69.1 J70.1 J71.1 J72.1 J73.1 J74.1 J75.1 J76.1 J77.1 J78.1 J79.1 J80.1 J81.1 J82.1 J83.1 J84.1 J85.1 J86.1 J87.1 J88.1 J89.1 J90.1 J91.1 J92.1 J93.1 J94.1 J95.1 J96.1 J97.1 J98.1 J99.1 J100.1 J101.1 J102.1 J103.1 J104.1 J105.1 J106.1 J107.1 J108.1 J109.1 J110.1 J111.1 J112.1 J113.1 J114.1 J115.1 J116.1 J117.1 J118.1 J119.1 J120.1 J121.1 J122.1 J123.1 J124.1 J125.1 J126.1 J127.1 J128.1 J129.1 J130.1 J131.1 J132.1 J133.1 J134.1 J135.1 J136.1 J137.1 J138.1 J139.1 J140.1 J141.1 J142.1 J143.1 J144.1 J145.1 J146.1 J147.1 J148.1 J149.1 J150.1 J151.1 J152.1 J153.1 J154.1 J155.1 J156.1 J157.1 J158.1 J159.1 J160.1 J161.1 J162.1 J163.1 J164.1 J165.1 J166.1 J167.1 J168.1 J169.1 J170.1 J171.1 J172.1 J173.1 J174.1 J175.1 J176.1 J177.1 J178.1 J179.1 J180.1 J181.1 J182.1 J183.1 J184.1 J185.1 J186.1 J187.1 J188.1 J189.1 J190.1 J191.1 J192.1 J193.1 J194.1 J195.1 J196.1 J197.1 J198.1 J199.1 J200.1 J201.1 J202.1 J203.1 J204.1 J205.1 J206.1 J207.1 J208.1 J209.1 J210.1 J211.1 J212.1 J213.1 J214.1 J215.1 J216.1 J217.1 J218.1 J219.1 J220.1 J221.1 J222.1 J223.1 J224.1 J225.1 J226.1 J227.1 J228.1 J229.1 J230.1 J231.1 J232.1 J233.1 J234.1 J235.1 J236.1 J237.1 J238.1 J239.1 J240.1 J241.1 J242.1 J243.1 J244.1 J245.1 J246.1 J247.1 J248.1 J249.1 J250.1 J251.1 J252.1 J253.1 J254.1 J255.1 J256.1
Unconnected: J64.3 J128.3 J192.3 J256.3

## Library data of the parts
C1-C4 = OPL Eagle Library:C-POLAR*
C5-C8 = OPL Eagle Library:C*
D-IN = OPL Eagle Library:CONNECTOR-HEADER-6P
DC = OPL Eagle Library:JACK-DC-3P
J1-J256 = OPL Eagle Library:CONNECTOR-HEADER-2X2P

## Board
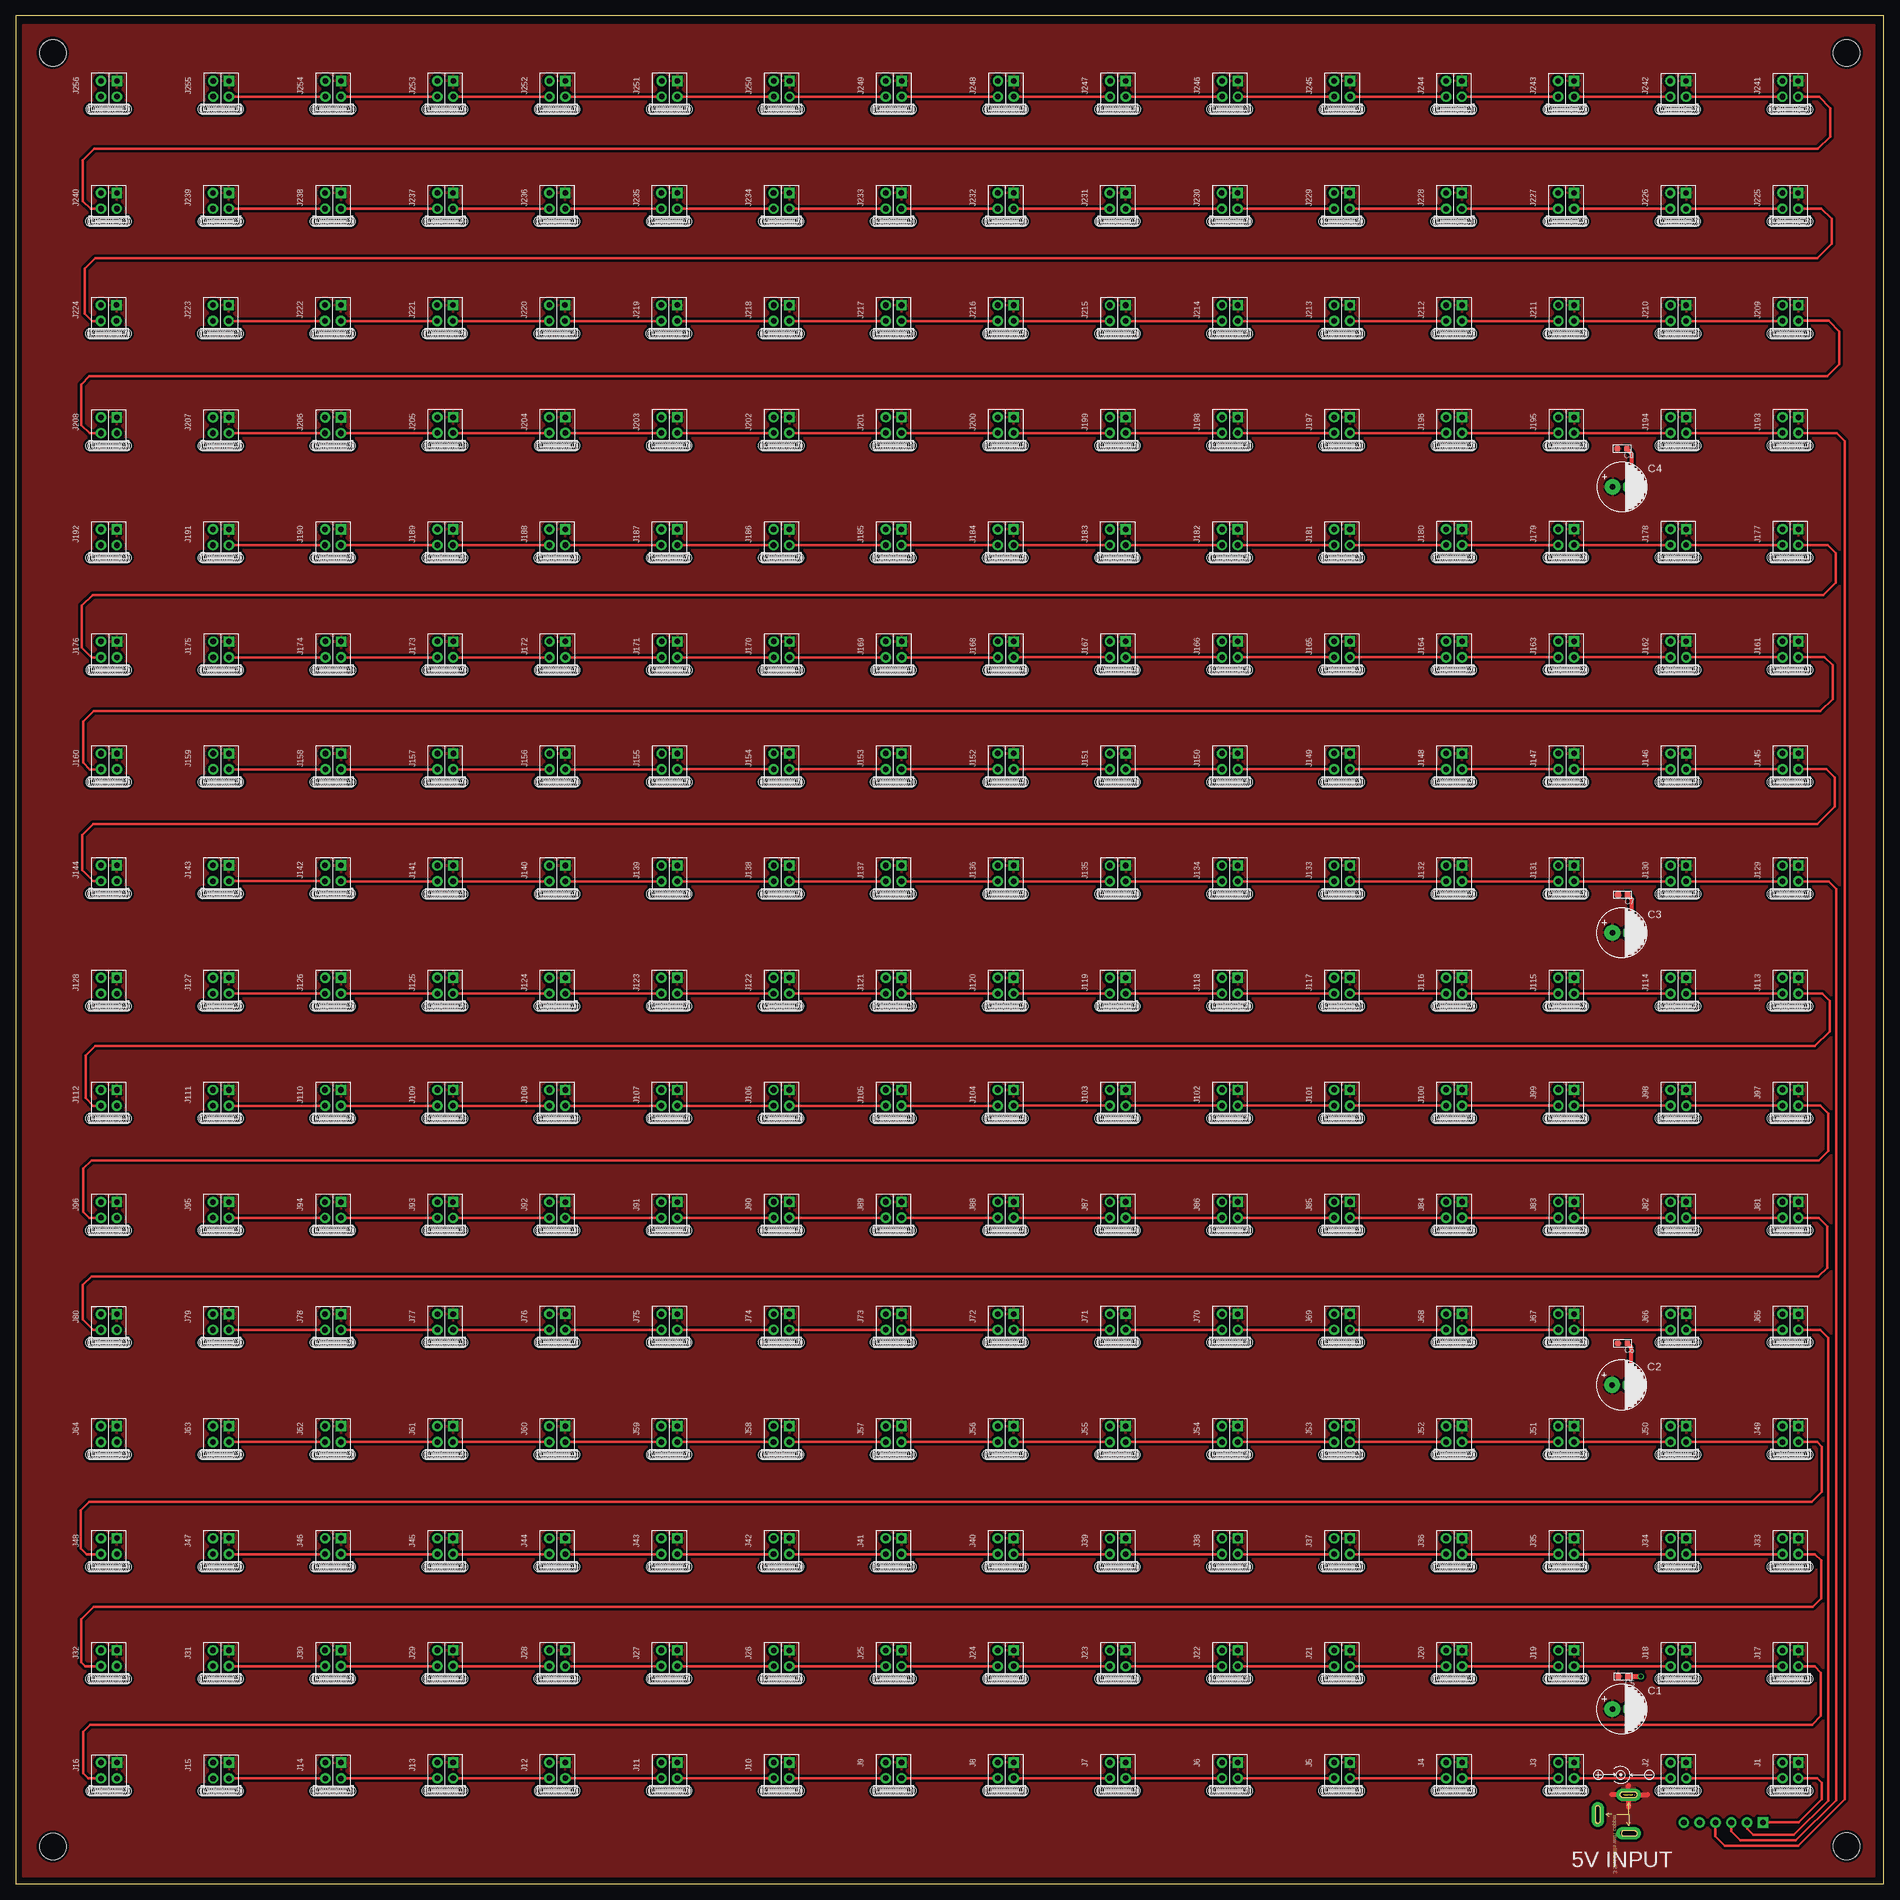
[diagram p2: board, top side]
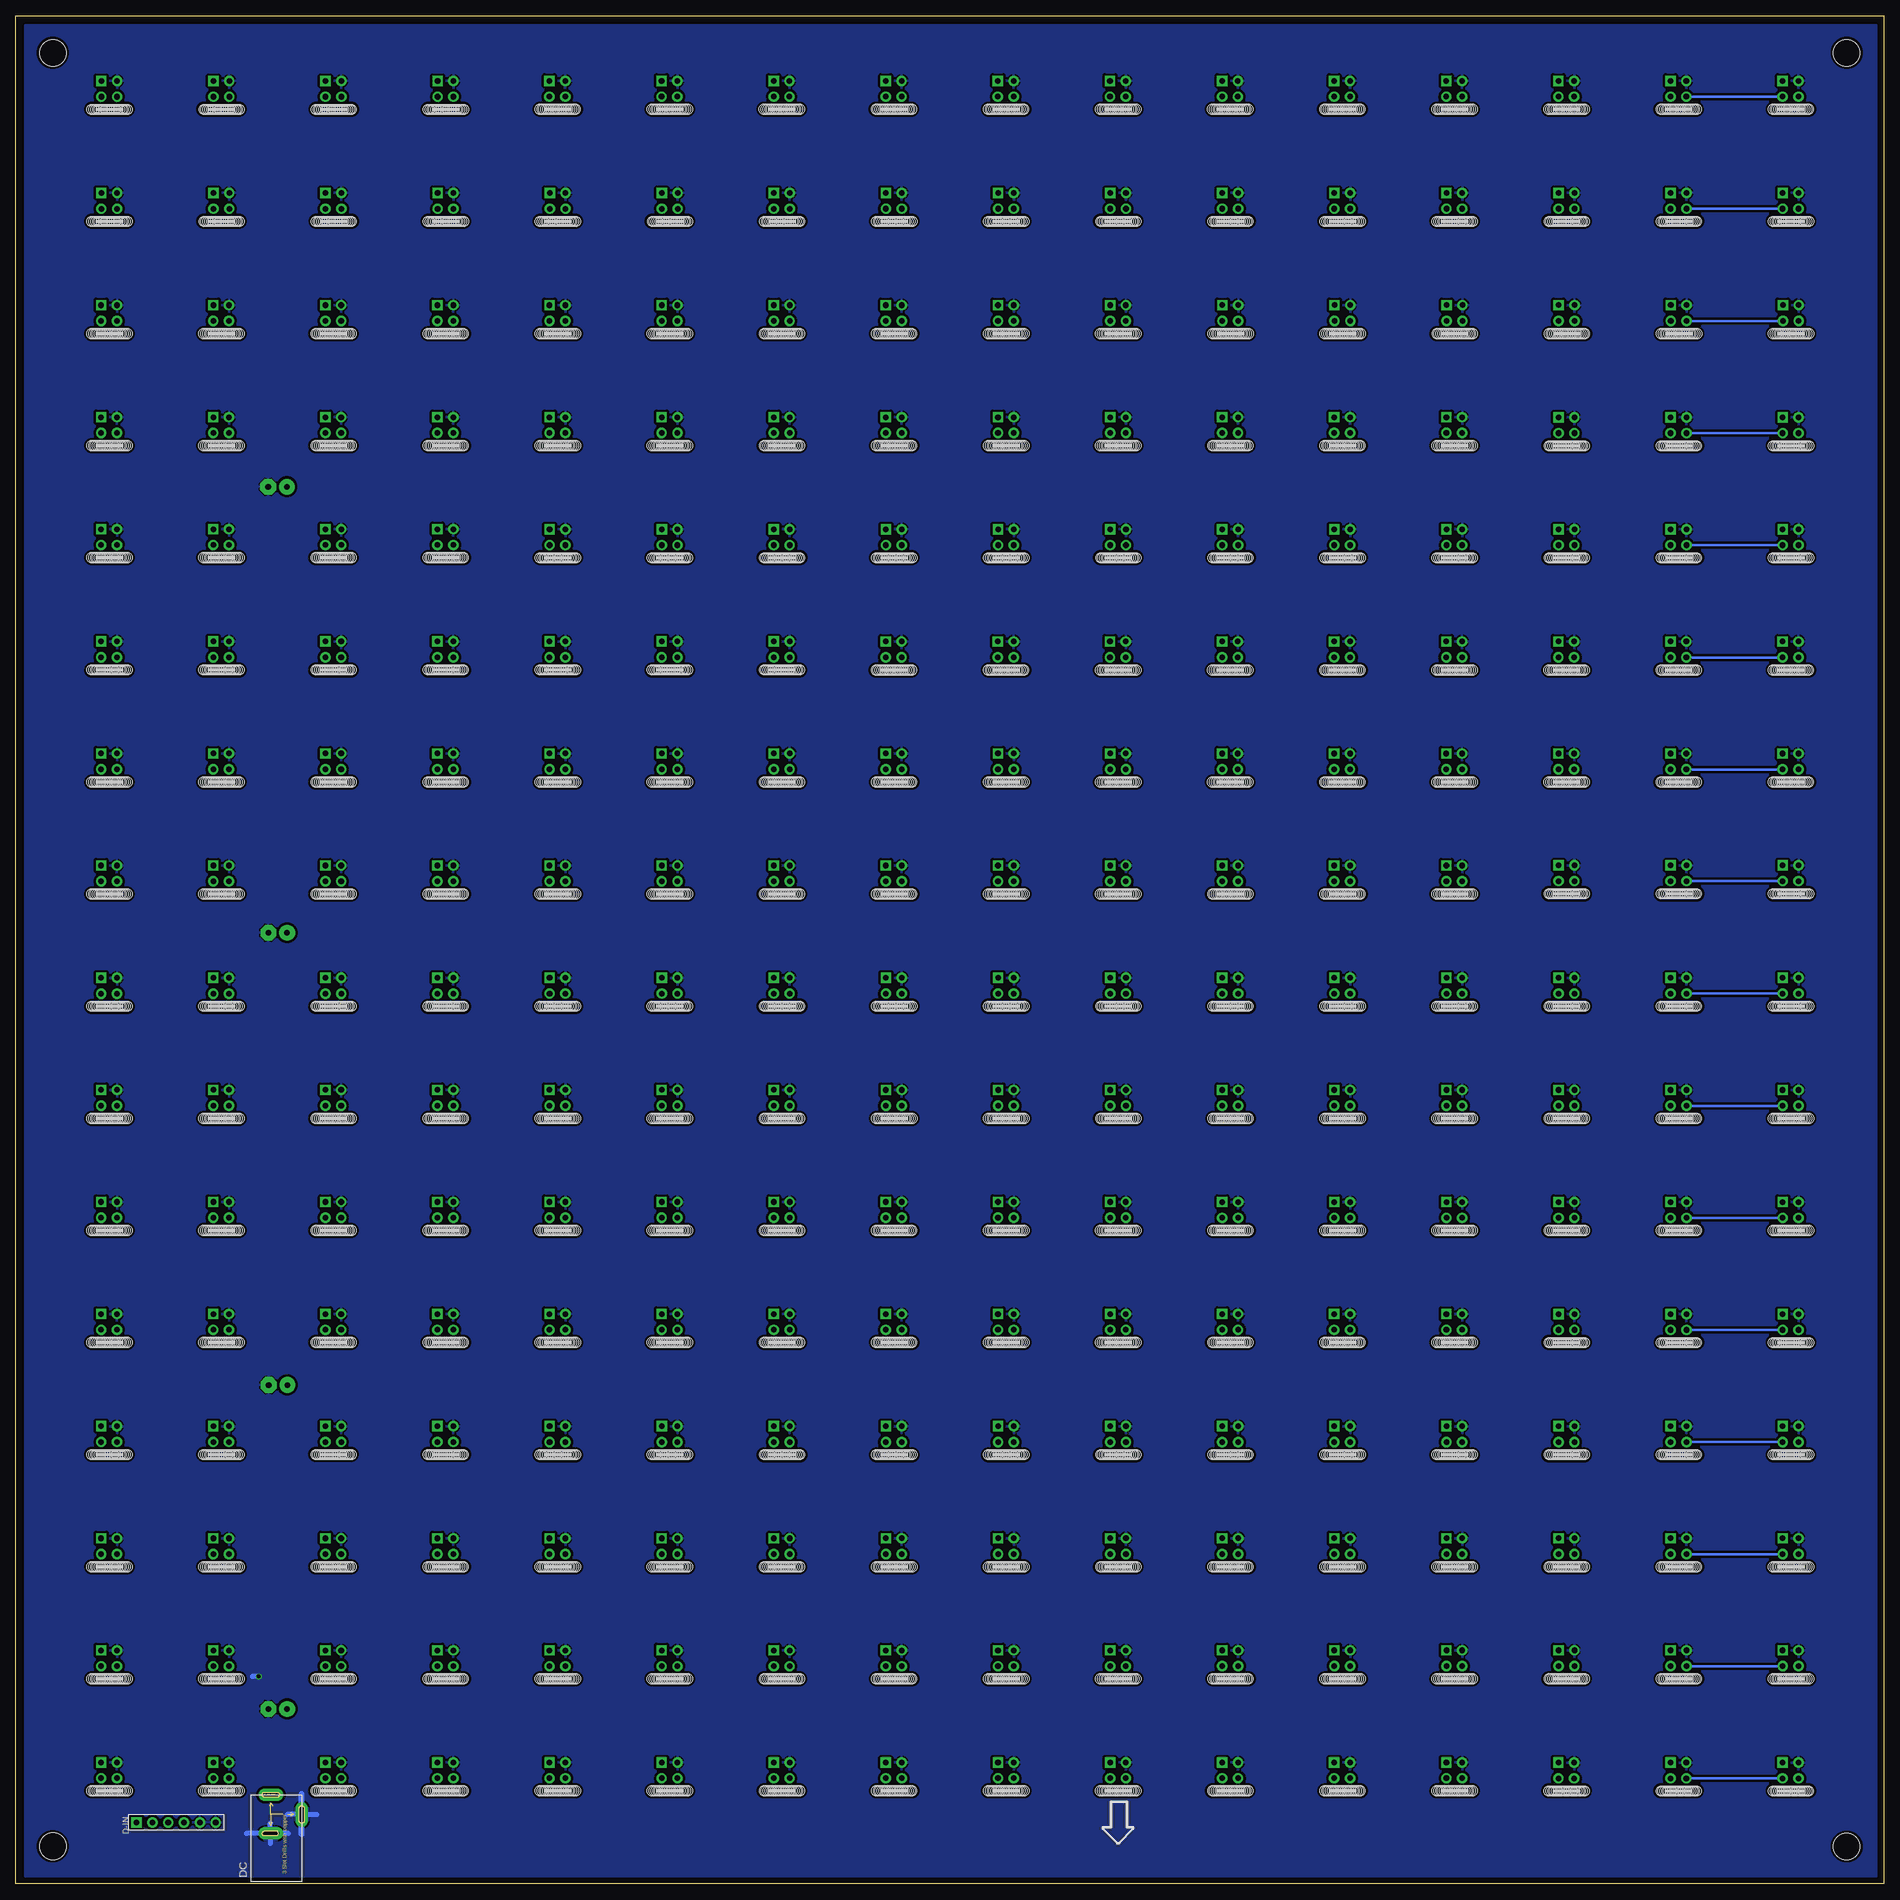
[diagram p3: board, bottom side, seen from below]

Size 300 x 300 mm. Coordinates in mm from the lower left corner, seen from the top.
Outline: 300,300 0,300 0,0 300,0 300,300
Copper layers (1*16): Top 0.035mm / dielectric 0.5mm / Bottom 0.035mm
Design rules "default *": minimum track width 10mil, minimum drill 15mil, track to track 8mil, track to pad 0mil, pad to pad 0mil, via to via 0mil, smd to smd 8mil, copper to edge 0mil, drill to drill 0mil, minimum pad ring 10mil, minimum via ring 0mil, stop-mask expansion 4mil, vias tented up to drill 0mil, thermal gap 10mil
Holes 4.3 mm at 5.99,294 294,294 294,6.05 5.99,6.02

### Footprints (pad centres in the part's own frame; a part is rotated, then mirrored left to right if it is on the bottom)
CAPACITOR-E3-8 = drill 0.9 pad 2.54: + -1.5,0 | drill 0.9 pad 2.54 octagon: - 1.5,0
C0603 = smd 0.889 x 0.889: 1 -0.762,0; 2 0.762,0
1X6P-2.54-2.54-11.6-3.0-BLACK-MALE = drill 0.889 pad 1.651 square: 1 0,6.35 | drill 0.889 pad 1.651: 2 0,3.81; 3 0,1.27; 4 0,-1.27; 5 0,-3.81; 6 0,-6.35
PW-3P-2.1 = drill 0.813 pad 2.032 long: + 6.985,0.889; -1 0.762,0.889; -2 3.81,-4.064 | drill 0.8: P$1 0.762,0.152; P$2 0.762,0.254; P$3 0.762,0.356; P$4 0.762,0.457; P$5 0.762,0.559; P$6 0.762,0.66; P$7 0.762,0.762; P$8 0.762,0.864; P$9 0.762,0.965; P$10 0.762,1.067; P$11 0.762,1.168; P$12 0.762,1.27; P$13 0.762,1.372; P$14 0.762,1.473; P$15 0.762,1.575; P$16 0.762,1.676; P$17 0.762,1.778; P$18 0.762,1.88; P$19 7.01,-0.102; P$20 7.01,0; P$21 7.01,0.102; P$22 7.01,0.203; P$23 7.01,0.305; P$24 7.01,0.406; P$25 7.01,0.508; P$26 7.01,0.61; P$27 7.01,0.711; P$28 7.01,0.813; P$29 7.01,0.914; P$30 7.01,1.016; P$31 7.01,1.118; P$32 7.01,1.219; P$33 7.01,1.321; P$34 7.01,1.422; P$35 7.01,1.524; P$36 7.01,1.575; P$37 7.01,1.676; P$38 7.01,1.778; P$39 7.01,1.88; P$40 2.845,-4.064; P$41 2.946,-4.064; P$42 3.048,-4.064; P$43 3.15,-4.064; P$44 3.251,-4.064; P$45 3.353,-4.064; P$46 3.454,-4.064; P$47 3.556,-4.064; P$48 3.658,-4.064; P$49 3.759,-4.064; P$50 3.861,-4.064; P$51 3.962,-4.064; P$52 4.064,-4.064; P$53 4.166,-4.064; P$54 4.267,-4.064; P$55 4.369,-4.064; P$56 4.47,-4.064; P$57 4.572,-4.064; P$58 4.674,-4.064; P$59 4.775,-4.064; P$60 0.762,0.051; P$61 0.762,-0.051
2X2P-2.54-REVERSE = drill 0.889 pad 1.651 square: 1 -1.27,-1.27 | drill 0.889 pad 1.651: 2 -1.27,1.27; 3 1.27,1.27; 4 1.27,-1.27 | hole 1.6: -2.8,3.3; -2.5,3.3; -2.2,3.3; -1.9,3.3; -1.6,3.3; -1.3,3.3; -1,3.3; -0.7,3.3; -0.4,3.3; -0.1,3.3; 0.2,3.3; 0.5,3.3; 0.8,3.3; 1.1,3.3; 1.4,3.3; 1.7,3.3; 2,3.3; 2.3,3.3; 2.6,3.3; 2.9,3.3

### Placement (x,y rotation side)
C1  257.91,28.09 0 top
C2  257.86,80.11 0 top
C3  257.91,152.73 0 top
C4  257.94,224.33 0 top
C5  258.11,33.3 180 top
C6  258.04,86.79 180 top
C7  258.06,158.83 180 top
C8  257.94,230.45 180 top
D-IN  274.22,9.88 90 bottom
DC  258.11,7.34 90 bottom
J1  284.99,18.24 180 top
J2  266.99,18.24 180 top
J3  248.99,18.24 180 top
J4  230.99,18.24 180 top
J5  212.99,18.24 180 top
J6  194.99,18.24 180 top
J7  176.99,18.24 180 top
J8  158.99,18.24 180 top
J9  140.99,18.24 180 top
J10  122.99,18.24 180 top
J11  104.99,18.24 180 top
J12  86.99,18.24 180 top
J13  68.99,18.24 180 top
J14  51,18.22 180 top
J15  33,18.22 180 top
J16  15,18.22 180 top
J17  284.99,36.23 180 top
J18  266.99,36.23 180 top
J19  248.99,36.23 180 top
J20  230.99,36.23 180 top
J21  212.99,36.23 180 top
J22  194.99,36.23 180 top
J23  176.99,36.23 180 top
J24  158.99,36.23 180 top
J25  140.99,36.23 180 top
J26  122.99,36.23 180 top
J27  104.98,36.24 180 top
J28  86.98,36.24 180 top
J29  68.98,36.24 180 top
J30  50.98,36.24 180 top
J31  32.98,36.24 180 top
J32  14.98,36.24 180 top
J33  284.99,54.22 180 top
J34  266.99,54.22 180 top
J35  248.99,54.22 180 top
J36  230.99,54.22 180 top
J37  212.99,54.22 180 top
J38  194.99,54.22 180 top
J39  176.99,54.22 180 top
J40  158.98,54.23 180 top
J41  140.98,54.23 180 top
J42  122.98,54.23 180 top
J43  104.98,54.23 180 top
J44  86.98,54.23 180 top
J45  68.98,54.23 180 top
J46  50.98,54.23 180 top
J47  32.98,54.23 180 top
J48  14.98,54.23 180 top
J49  284.99,72.24 180 top
J50  266.99,72.24 180 top
J51  248.99,72.24 180 top
J52  230.99,72.24 180 top
J53  212.98,72.22 180 top
J54  194.98,72.22 180 top
J55  176.98,72.22 180 top
J56  158.98,72.22 180 top
J57  140.98,72.22 180 top
J58  122.98,72.22 180 top
J59  104.98,72.22 180 top
J60  86.98,72.22 180 top
J61  68.98,72.22 180 top
J62  50.98,72.22 180 top
J63  32.98,72.22 180 top
J64  14.98,72.22 180 top
J65  284.99,90.25 180 top
J66  266.99,90.25 180 top
J67  248.99,90.25 180 top
J68  230.99,90.25 180 top
J69  212.99,90.25 180 top
J70  194.99,90.25 180 top
J71  176.99,90.25 180 top
J72  158.99,90.25 180 top
J73  140.99,90.25 180 top
J74  122.99,90.25 180 top
J75  104.99,90.25 180 top
J76  86.99,90.25 180 top
J77  68.99,90.25 180 top
J78  50.98,90.23 180 top
J79  32.98,90.23 180 top
J80  14.98,90.23 180 top
J81  284.99,108.24 180 top
J82  266.99,108.24 180 top
J83  248.99,108.24 180 top
J84  230.99,108.24 180 top
J85  212.99,108.24 180 top
J86  194.99,108.24 180 top
J87  176.99,108.24 180 top
J88  158.99,108.24 180 top
J89  140.99,108.24 180 top
J90  122.99,108.24 180 top
J91  104.98,108.22 180 top
J92  86.98,108.22 180 top
J93  68.98,108.22 180 top
J94  50.98,108.22 180 top
J95  32.98,108.22 180 top
J96  14.98,108.22 180 top
J97  284.99,126.23 180 top
J98  266.99,126.23 180 top
J99  248.99,126.23 180 top
J100  230.99,126.23 180 top
J101  212.99,126.23 180 top
J102  194.99,126.23 180 top
J103  176.99,126.23 180 top
J104  158.98,126.21 180 top
J105  140.98,126.21 180 top
J106  122.98,126.21 180 top
J107  104.98,126.21 180 top
J108  86.98,126.21 180 top
J109  68.98,126.21 180 top
J110  50.98,126.21 180 top
J111  32.98,126.21 180 top
J112  14.98,126.21 180 top
J113  284.99,144.22 180 top
J114  266.99,144.22 180 top
J115  248.99,144.22 180 top
J116  230.99,144.22 180 top
J117  212.98,144.23 180 top
J118  194.98,144.23 180 top
J119  176.98,144.23 180 top
J120  158.98,144.23 180 top
J121  140.98,144.23 180 top
J122  122.98,144.23 180 top
J123  104.98,144.23 180 top
J124  86.98,144.23 180 top
J125  68.98,144.23 180 top
J126  50.98,144.23 180 top
J127  32.98,144.23 180 top
J128  14.98,144.23 180 top
J129  284.99,162.26 180 top
J130  266.99,162.26 180 top
J131  248.99,162.26 180 top
J132  230.99,162.26 180 top
J133  212.99,162.26 180 top
J134  194.99,162.26 180 top
J135  176.99,162.26 180 top
J136  158.99,162.26 180 top
J137  140.99,162.26 180 top
J138  122.99,162.26 180 top
J139  104.99,162.26 180 top
J140  86.99,162.26 180 top
J141  68.99,162.26 180 top
J142  50.98,162.29 180 top
J143  32.98,162.29 180 top
J144  14.98,162.29 180 top
J145  284.99,180.25 180 top
J146  266.99,180.25 180 top
J147  248.99,180.25 180 top
J148  230.99,180.25 180 top
J149  212.99,180.25 180 top
J150  194.99,180.25 180 top
J151  176.99,180.25 180 top
J152  158.99,180.25 180 top
J153  140.99,180.25 180 top
J154  122.99,180.25 180 top
J155  105,180.23 180 top
J156  87,180.23 180 top
J157  69,180.23 180 top
J158  51,180.23 180 top
J159  33,180.23 180 top
J160  15,180.23 180 top
J161  284.99,198.24 180 top
J162  266.99,198.24 180 top
J163  248.99,198.24 180 top
J164  230.99,198.24 180 top
J165  212.99,198.24 180 top
J166  194.99,198.24 180 top
J167  176.99,198.24 180 top
J168  159,198.22 180 top
J169  141,198.22 180 top
J170  123,198.22 180 top
J171  105,198.22 180 top
J172  87,198.22 180 top
J173  69,198.22 180 top
J174  51,198.22 180 top
J175  33,198.22 180 top
J176  15,198.22 180 top
J177  284.99,216.26 180 top
J178  266.99,216.26 180 top
J179  248.99,216.26 180 top
J180  230.99,216.26 180 top
J181  212.98,216.24 180 top
J182  194.98,216.24 180 top
J183  176.98,216.24 180 top
J184  158.98,216.24 180 top
J185  140.98,216.24 180 top
J186  122.98,216.24 180 top
J187  104.98,216.24 180 top
J188  86.98,216.24 180 top
J189  68.98,216.24 180 top
J190  50.98,216.24 180 top
J191  32.98,216.24 180 top
J192  14.98,216.24 180 top
J193  284.99,234.24 180 top
J194  266.99,234.24 180 top
J195  248.99,234.24 180 top
J196  230.99,234.24 180 top
J197  212.99,234.24 180 top
J198  194.99,234.24 180 top
J199  176.99,234.24 180 top
J200  158.99,234.24 180 top
J201  140.99,234.24 180 top
J202  122.99,234.24 180 top
J203  104.99,234.24 180 top
J204  86.99,234.24 180 top
J205  68.99,234.24 180 top
J206  50.98,234.22 180 top
J207  32.98,234.22 180 top
J208  14.98,234.22 180 top
J209  284.99,252.23 180 top
J210  266.99,252.23 180 top
J211  248.99,252.23 180 top
J212  230.99,252.23 180 top
J213  212.99,252.23 180 top
J214  194.99,252.23 180 top
J215  176.99,252.23 180 top
J216  158.99,252.23 180 top
J217  140.99,252.23 180 top
J218  122.99,252.23 180 top
J219  104.95,252.24 180 top
J220  86.95,252.24 180 top
J221  68.95,252.24 180 top
J222  50.95,252.24 180 top
J223  32.95,252.24 180 top
J224  14.95,252.24 180 top
J225  284.96,270.25 180 top
J226  266.96,270.25 180 top
J227  248.96,270.25 180 top
J228  230.96,270.25 180 top
J229  212.96,270.25 180 top
J230  194.96,270.25 180 top
J231  176.96,270.25 180 top
J232  158.98,270.26 180 top
J233  140.98,270.26 180 top
J234  122.98,270.26 180 top
J235  104.98,270.26 180 top
J236  86.98,270.26 180 top
J237  68.98,270.26 180 top
J238  50.98,270.26 180 top
J239  32.98,270.26 180 top
J240  14.98,270.26 180 top
J241  284.96,288.24 180 top
J242  266.96,288.24 180 top
J243  248.96,288.24 180 top
J244  230.96,288.24 180 top
J245  213,288.25 180 top
J246  195,288.25 180 top
J247  177,288.25 180 top
J248  159,288.25 180 top
J249  141,288.25 180 top
J250  123,288.25 180 top
J251  105,288.25 180 top
J252  87,288.25 180 top
J253  69,288.25 180 top
J254  51,288.25 180 top
J255  33,288.25 180 top
J256  15,288.25 180 top

### Tracks (layer width: path | path; a pad name or v marks a point on that pad's centre or on a via)
DIN_1
  Top 0.406: D-IN.1 286.31,9.88 290.04,13.61 290.04,16.23 289.33,16.94 286.28,16.94 J1.2
DIN_2
  Top 0.406: D-IN.2 278.03,8.87 279.02,7.87 285.52,7.87 291.03,13.39 291.03,87.68 289.74,88.98 J65.2
DIN_3
  Top 0.406: D-IN.3 275.49,8.43 276.94,6.99 285.88,6.99 292.35,13.46 292.35,159.79 291.16,160.99 J129.2
DIN_4
  Top 0.406: D-IN.4 272.95,7.64 274.45,6.15 286.23,6.15 293.7,13.61 293.7,231.67 292.4,232.97 J193.2
GND  (via drill 0.6)
  Top 0.61: C6.1 259.36,86.23 C2.- | C7.1 259.41,158.24 C3.- | C8.1 259.44,229.72 C4.-
  Top 0.813: C5.1 260.96,33.3 v260.96,33.33
  Bottom 0.813: 256.18,8.13 262.89,8.13 | 257.86,8.13 259.08,8.13 | 259.08,8.13 259.08,9.75 | 259.08,8.13 259.08,6.5 | 254.1,12.09 254.05,12.09 | 254.05,12.09 254.05,11.18 | 254.05,11.18 254.05,7.92 254.1,7.92 254.1,14.48 254.05,14.48 254.05,12.09 | 254.05,11.18 256.34,11.18 | 254.05,11.18 251.61,11.18 | v260.96,33.33 261.98,33.33
  pour Bottom (isolate 0.406): 1.27,298.45 298.45,298.45 298.45,1.27 1.27,1.27
N$1
  Top 0.406: J2.2 J1.3
N$2
  Top 0.406: J3.2 J2.3
N$3
  Top 0.406: J3.3 J4.2
N$4
  Top 0.406: J5.3 J6.2
N$5
  Top 0.406: J6.3 J7.2
N$6
  Top 0.406: J7.3 J8.2
N$7
  Top 0.406: J4.3 J5.2
N$8
  Top 0.406: J9.3 J10.2
N$9
  Top 0.406: J10.3 J11.2
N$10
  Top 0.406: J11.3 J12.2
N$11
  Top 0.406: J13.3 52.29,16.97 J14.2
N$12
  Top 0.406: J14.3 J15.2
N$13
  Bottom 0.406: J15.3 J16.2
N$14
  Top 0.406: J12.3 J13.2
N$15
  Top 0.406: J17.3 J18.2
N$16
  Top 0.406: J18.3 J19.2
N$17
  Top 0.406: J19.3 J20.2
N$18
  Top 0.406: J21.3 J22.2
N$19
  Top 0.406: J22.3 J23.2
N$20
  Top 0.406: J23.3 J24.2
N$21
  Top 0.406: J20.3 J21.2
N$22
  Top 0.406: J25.3 J26.2
N$23
  Top 0.406: J26.3 J27.2
N$24
  Top 0.406: J27.3 J28.2
N$25
  Top 0.406: J29.3 J30.2
N$26
  Top 0.406: J30.3 J31.2
N$27
  Bottom 0.406: J31.3 J32.2
N$28
  Top 0.406: J28.3 J29.2
N$29
  Top 0.406: J8.3 J9.2
N$30
  Top 0.406: J16.3 11.7,16.95 10.85,17.8 10.85,24.46 11.96,25.58 288.49,25.58 289.89,26.98 289.89,33.93 288.9,34.92 286.29,34.92 J17.2
N$31
  Top 0.406: J24.3 J25.2
N$32
  Top 0.406: J65.3 J66.2
N$33
  Top 0.406: J33.3 J34.2
N$34
  Top 0.406: J34.3 J35.2
N$35
  Top 0.406: J35.3 J36.2
N$36
  Top 0.406: J37.3 J38.2
N$37
  Top 0.406: J38.3 J39.2
N$38
  Top 0.406: J39.3 J40.2
N$39
  Top 0.406: J36.3 J37.2
N$40
  Top 0.406: J41.3 J42.2
N$41
  Top 0.406: J42.3 J43.2
N$42
  Top 0.406: J43.3 J44.2
N$43
  Top 0.406: J45.3 J46.2
N$44
  Top 0.406: J46.3 J47.2
N$45
  Bottom 0.406: J47.3 J48.2
N$46
  Top 0.406: J44.3 J45.2
N$47
  Top 0.406: J49.3 J50.2
N$48
  Top 0.406: J50.3 J51.2
N$49
  Top 0.406: J51.3 J52.2
N$50
  Top 0.406: J53.3 J54.2
N$51
  Top 0.406: J54.3 J55.2
N$52
  Top 0.406: J55.3 J56.2
N$53
  Top 0.406: J52.3 214.27,70.97 J53.2
N$54
  Top 0.406: J57.3 J58.2
N$55
  Top 0.406: J58.3 J59.2
N$56
  Top 0.406: J59.3 J60.2
N$57
  Top 0.406: J61.3 J62.2
N$58
  Top 0.406: J62.3 J63.2
N$59
  Bottom 0.406: J63.3 J64.2
N$60
  Top 0.406: J60.3 J61.2
N$61
  Top 0.406: J40.3 J41.2
N$62
  Top 0.406: J48.3 11.4,52.96 10.44,53.92 10.44,59.97 11.84,61.37 288.42,61.37 290.04,62.99 290.04,70.21 289.28,70.97 J49.2
N$63
  Top 0.406: J56.3 J57.2
N$64
  Top 0.406: J32.3 11.21,34.97 10.57,35.61 10.57,42.52 12.55,44.5 288.54,44.5 289.92,45.87 289.92,51.97 288.93,52.96 J33.2
N$65
  Top 0.406: J66.3 J67.2
N$66
  Top 0.406: J67.3 J68.2
N$67
  Top 0.406: J69.3 J70.2
N$68
  Top 0.406: J70.3 J71.2
N$69
  Top 0.406: J71.3 J72.2
N$70
  Top 0.406: J68.3 J69.2
N$71
  Top 0.406: J73.3 J74.2
N$72
  Top 0.406: J74.3 J75.2
N$73
  Top 0.406: J75.3 J76.2
N$74
  Top 0.406: J77.3 52.27,88.98 J78.2
N$75
  Top 0.406: J78.3 J79.2
N$76
  Bottom 0.406: J79.3 J80.2
N$77
  Top 0.406: J76.3 J77.2
N$78
  Top 0.406: J81.3 J82.2
N$79
  Top 0.406: J82.3 J83.2
N$80
  Top 0.406: J83.3 J84.2
N$81
  Top 0.406: J85.3 J86.2
N$82
  Top 0.406: J86.3 J87.2
N$83
  Top 0.406: J87.3 J88.2
N$84
  Top 0.406: J84.3 J85.2
N$85
  Top 0.406: J89.3 J90.2
N$86
  Top 0.406: J90.3 106.27,106.97 J91.2
N$87
  Top 0.406: J91.3 J92.2
N$88
  Top 0.406: J93.3 J94.2
N$89
  Top 0.406: J94.3 J95.2
N$90
  Bottom 0.406: J95.3 J96.2
N$91
  Top 0.406: J92.3 J93.2
N$92
  Top 0.406: J72.3 J73.2
N$93
  Top 0.406: J80.3 12.49,88.96 10.82,90.63 10.82,96.16 12.19,97.54 289.48,97.54 290.88,98.93 290.88,105.59 289.51,106.96 J81.2
N$94
  Top 0.406: J88.3 J89.2
N$95
  Top 0.406: J97.3 J98.2
N$96
  Top 0.406: J98.3 J99.2
N$97
  Top 0.406: J99.3 J100.2
N$98
  Top 0.406: J101.3 J102.2
N$99
  Top 0.406: J102.3 J103.2
N$100
  Top 0.406: J103.3 160.26,124.96 J104.2
N$101
  Top 0.406: J100.3 J101.2
N$102
  Top 0.406: J105.3 J106.2
N$103
  Top 0.406: J106.3 J107.2
N$104
  Top 0.406: J107.3 J108.2
N$105
  Top 0.406: J109.3 J110.2
N$106
  Top 0.406: J110.3 J111.2
N$107
  Bottom 0.406: J111.3 J112.2
N$108
  Top 0.406: J108.3 J109.2
N$109
  Top 0.406: J113.3 J114.2
N$110
  Top 0.406: J114.3 J115.2
N$111
  Top 0.406: J115.3 J116.2
N$112
  Top 0.406: J117.3 J118.2
N$113
  Top 0.406: J118.3 J119.2
N$114
  Top 0.406: J119.3 J120.2
N$115
  Top 0.406: J116.3 J117.2
N$116
  Top 0.406: J121.3 J122.2
N$117
  Top 0.406: J122.3 J123.2
N$118
  Top 0.406: J123.3 J124.2
N$119
  Top 0.406: J125.3 J126.2
N$120
  Top 0.406: J126.3 J127.2
N$121
  Bottom 0.406: J127.3 J128.2
N$122
  Top 0.406: J124.3 J125.2
N$123
  Top 0.406: J104.3 J105.2
N$124
  Top 0.406: J112.3 12.47,124.94 11.25,126.16 11.25,133.04 12.75,134.54 288.93,134.54 291.29,136.91 291.29,141.76 290.09,142.95 J113.2
N$125
  Top 0.406: J120.3 J121.2
N$126
  Top 0.406: J96.3 11.82,106.95 10.9,107.87 10.9,114.86 12.24,116.2 289.54,116.2 291.06,117.73 291.06,123.72 289.81,124.97 J97.2
N$127
  Top 0.406: J129.3 J130.2
N$128
  Top 0.406: J130.3 J131.2
N$129
  Top 0.406: J131.3 J132.2
N$130
  Top 0.406: J133.3 J134.2
N$131
  Top 0.406: J134.3 J135.2
N$132
  Top 0.406: J135.3 J136.2
N$133
  Top 0.406: J132.3 J133.2
N$134
  Top 0.406: J137.3 J138.2
N$135
  Top 0.406: J138.3 J139.2
N$136
  Top 0.406: J139.3 J140.2
N$137
  Top 0.406: J141.3 52.28,160.99 J142.2
N$138
  Top 0.406: J142.3 J143.2
N$139
  Bottom 0.406: J143.3 J144.2 | J144.2 15.6,161.02 15.6,160.99 16.25,160.99 J144.2
N$140
  Top 0.406: J140.3 J141.2
N$141
  Top 0.406: J145.3 J146.2
N$142
  Top 0.406: J146.3 J147.2
N$143
  Top 0.406: J147.3 J148.2
N$144
  Top 0.406: J149.3 J150.2
N$145
  Top 0.406: J150.3 J151.2
N$146
  Top 0.406: J151.3 J152.2
N$147
  Top 0.406: J148.3 J149.2
N$148
  Top 0.406: J153.3 J154.2
N$149
  Top 0.406: J154.3 106.27,178.98 J155.2
N$150
  Top 0.406: J155.3 89.05,178.96 89.05,178.97 J156.2
N$151
  Top 0.406: J157.3 J158.2
N$152
  Top 0.406: J158.3 J159.2
N$153
  Bottom 0.406: J159.3 J160.2
N$154
  Top 0.406: J156.3 J157.2
N$155
  Top 0.406: J136.3 J137.2
N$156
  Top 0.406: J144.3 12.49,161.02 10.72,162.79 10.72,168.43 12.47,170.18 289.31,170.18 292.12,173 292.12,177.62 290.75,178.99 286.27,178.99 J145.2
N$157
  Top 0.406: J152.3 J153.2
N$158
  Top 0.406: J161.3 J162.2
N$159
  Top 0.406: J162.3 J163.2
N$160
  Top 0.406: J163.3 J164.2
N$161
  Top 0.406: J165.3 J166.2
N$162
  Top 0.406: J166.3 J167.2
N$163
  Top 0.406: J167.3 160.29,196.97 J168.2
N$164
  Top 0.406: J164.3 J165.2
N$165
  Top 0.406: J169.3 J170.2
N$166
  Top 0.406: J170.3 J171.2
N$167
  Top 0.406: J171.3 J172.2
N$168
  Top 0.406: J173.3 J174.2
N$169
  Top 0.406: J174.3 J175.2
N$170
  Bottom 0.406: J175.3 J176.2
N$171
  Top 0.406: J172.3 J173.2
N$172
  Top 0.406: J177.3 J178.2
N$173
  Top 0.406: J178.3 J179.2
N$174
  Top 0.406: J179.3 J180.2
N$175
  Top 0.406: J181.3 J182.2
N$176
  Top 0.406: J182.3 J183.2
N$177
  Top 0.406: J183.3 J184.2
N$178
  Top 0.406: J180.3 214.27,214.99 J181.2
N$179
  Top 0.406: J185.3 J186.2
N$180
  Top 0.406: J186.3 J187.2
N$181
  Top 0.406: J187.3 J188.2
N$182
  Top 0.406: J189.3 J190.2
N$183
  Top 0.406: J190.3 J191.2
N$184
  Bottom 0.406: J191.3 J192.2
N$185
  Top 0.406: J188.3 J189.2
N$186
  Top 0.406: J168.3 J169.2
N$187
  Top 0.406: J176.3 12.22,196.95 10.64,198.53 10.64,205.23 12.37,206.96 290.27,206.96 292.23,208.91 292.23,213.69 290.96,214.96 286.28,214.96 J177.2
N$188
  Top 0.406: J184.3 J185.2
N$189
  Top 0.406: J160.3 11.92,178.96 10.85,180.03 10.85,186.66 12.52,188.34 289.81,188.34 291.74,190.27 291.74,195.71 290.42,197.03 286.32,197.03 J161.2
N$190
  Top 0.406: J193.3 J194.2
N$191
  Top 0.406: J194.3 J195.2
N$192
  Top 0.406: J195.3 J196.2
N$193
  Top 0.406: J197.3 J198.2
N$194
  Top 0.406: J198.3 J199.2
N$195
  Top 0.406: J199.3 J200.2
N$196
  Top 0.406: J196.3 J197.2
N$197
  Top 0.406: J201.3 J202.2
N$198
  Top 0.406: J202.3 J203.2
N$199
  Top 0.406: J203.3 J204.2
N$200
  Top 0.406: J205.3 52.27,232.97 J206.2
N$201
  Top 0.406: J206.3 J207.2
N$202
  Bottom 0.406: J207.3 J208.2
N$203
  Top 0.406: J204.3 J205.2
N$204
  Top 0.406: J209.3 J210.2
N$205
  Top 0.406: J210.3 J211.2
N$206
  Top 0.406: J211.3 J212.2
N$207
  Top 0.406: J213.3 J214.2
N$208
  Top 0.406: J214.3 J215.2
N$209
  Top 0.406: J215.3 J216.2
N$210
  Top 0.406: J212.3 J213.2
N$211
  Top 0.406: J217.3 J218.2
N$212
  Top 0.406: J218.3 J219.2
N$213
  Top 0.406: J219.3 J220.2
N$214
  Top 0.406: J221.3 J222.2
N$215
  Top 0.406: J222.3 J223.2
N$216
  Bottom 0.406: J223.3 J224.2
N$217
  Top 0.406: J220.3 J221.2
N$218
  Top 0.406: J200.3 J201.2
N$219
  Top 0.406: J208.3 11.88,232.95 10.57,234.26 10.57,240.77 11.86,242.06 290.88,242.06 292.86,244.04 292.86,249.28 291.16,250.98 286.27,250.98 J209.2
N$220
  Top 0.406: J216.3 J217.2
N$221
  Top 0.406: J225.3 J226.2
N$222
  Top 0.406: J226.3 J227.2
N$223
  Top 0.406: J227.3 J228.2
N$224
  Top 0.406: J229.3 J230.2
N$225
  Top 0.406: J230.3 J231.2
N$226
  Top 0.406: J231.3 160.26,268.98 J232.2
N$227
  Top 0.406: J228.3 J229.2
N$228
  Top 0.406: J233.3 J234.2
N$229
  Top 0.406: J234.3 J235.2
N$230
  Top 0.406: J235.3 J236.2
N$231
  Top 0.406: J237.3 J238.2
N$232
  Top 0.406: J238.3 J239.2
N$233
  Bottom 0.406: J239.3 J240.2
N$234
  Top 0.406: J236.3 J237.2
N$235
  Top 0.406: J241.3 J242.2
N$236
  Top 0.406: J242.3 J243.2
N$237
  Top 0.406: J243.3 J244.2
N$238
  Top 0.406: J245.3 J246.2
N$239
  Top 0.406: J246.3 J247.2
N$240
  Top 0.406: J247.3 J248.2
N$241
  Top 0.406: J244.3 214.28,286.97 J245.2
N$242
  Top 0.406: J249.3 J250.2
N$243
  Top 0.406: J250.3 J251.2
N$244
  Top 0.406: J251.3 J252.2
N$245
  Top 0.406: J253.3 J254.2
N$246
  Top 0.406: J254.3 J255.2
N$247
  Bottom 0.406: J255.3 J256.2
N$248
  Top 0.406: J252.3 J253.2
N$249
  Top 0.406: J232.3 J233.2
N$250
  Top 0.406: J240.3 12.06,268.99 10.82,270.23 10.82,276.78 12.62,278.59 289.41,278.59 291.39,280.57 291.39,285.14 289.58,286.94 286.26,286.94 J241.2
N$251
  Top 0.406: J248.3 J249.2
N$252
  Top 0.406: J224.3 12.3,250.97 11.12,252.15 11.12,259.38 12.8,261.06 289.31,261.06 291.59,263.35 291.59,267.36 289.97,268.99 J225.2
V+  (15 unrouted)
  Top 0.813: DC.+ 258.14,14.33 DC.P$20 DC.P$35 | DC.+ 262.03,14.33 | DC.P$19 257.99,14.33 256.24,14.33 | DC.+ 258.98,14.3 258.98,12.34 | DC.P$28 258.98,14.4 258.98,15.8 | DC.P$35 DC.P$37 | DC.P$38 DC.P$35
  pour Top (isolate 0.406): 1.27,298.45 298.45,298.45 298.45,1.27 1.27,1.27

### Text on the board
tPlace: 5V INPUT